# EAGLE design DigitalStethoscope (EAGLE 8.1.0)

## Sheet 1 of 5
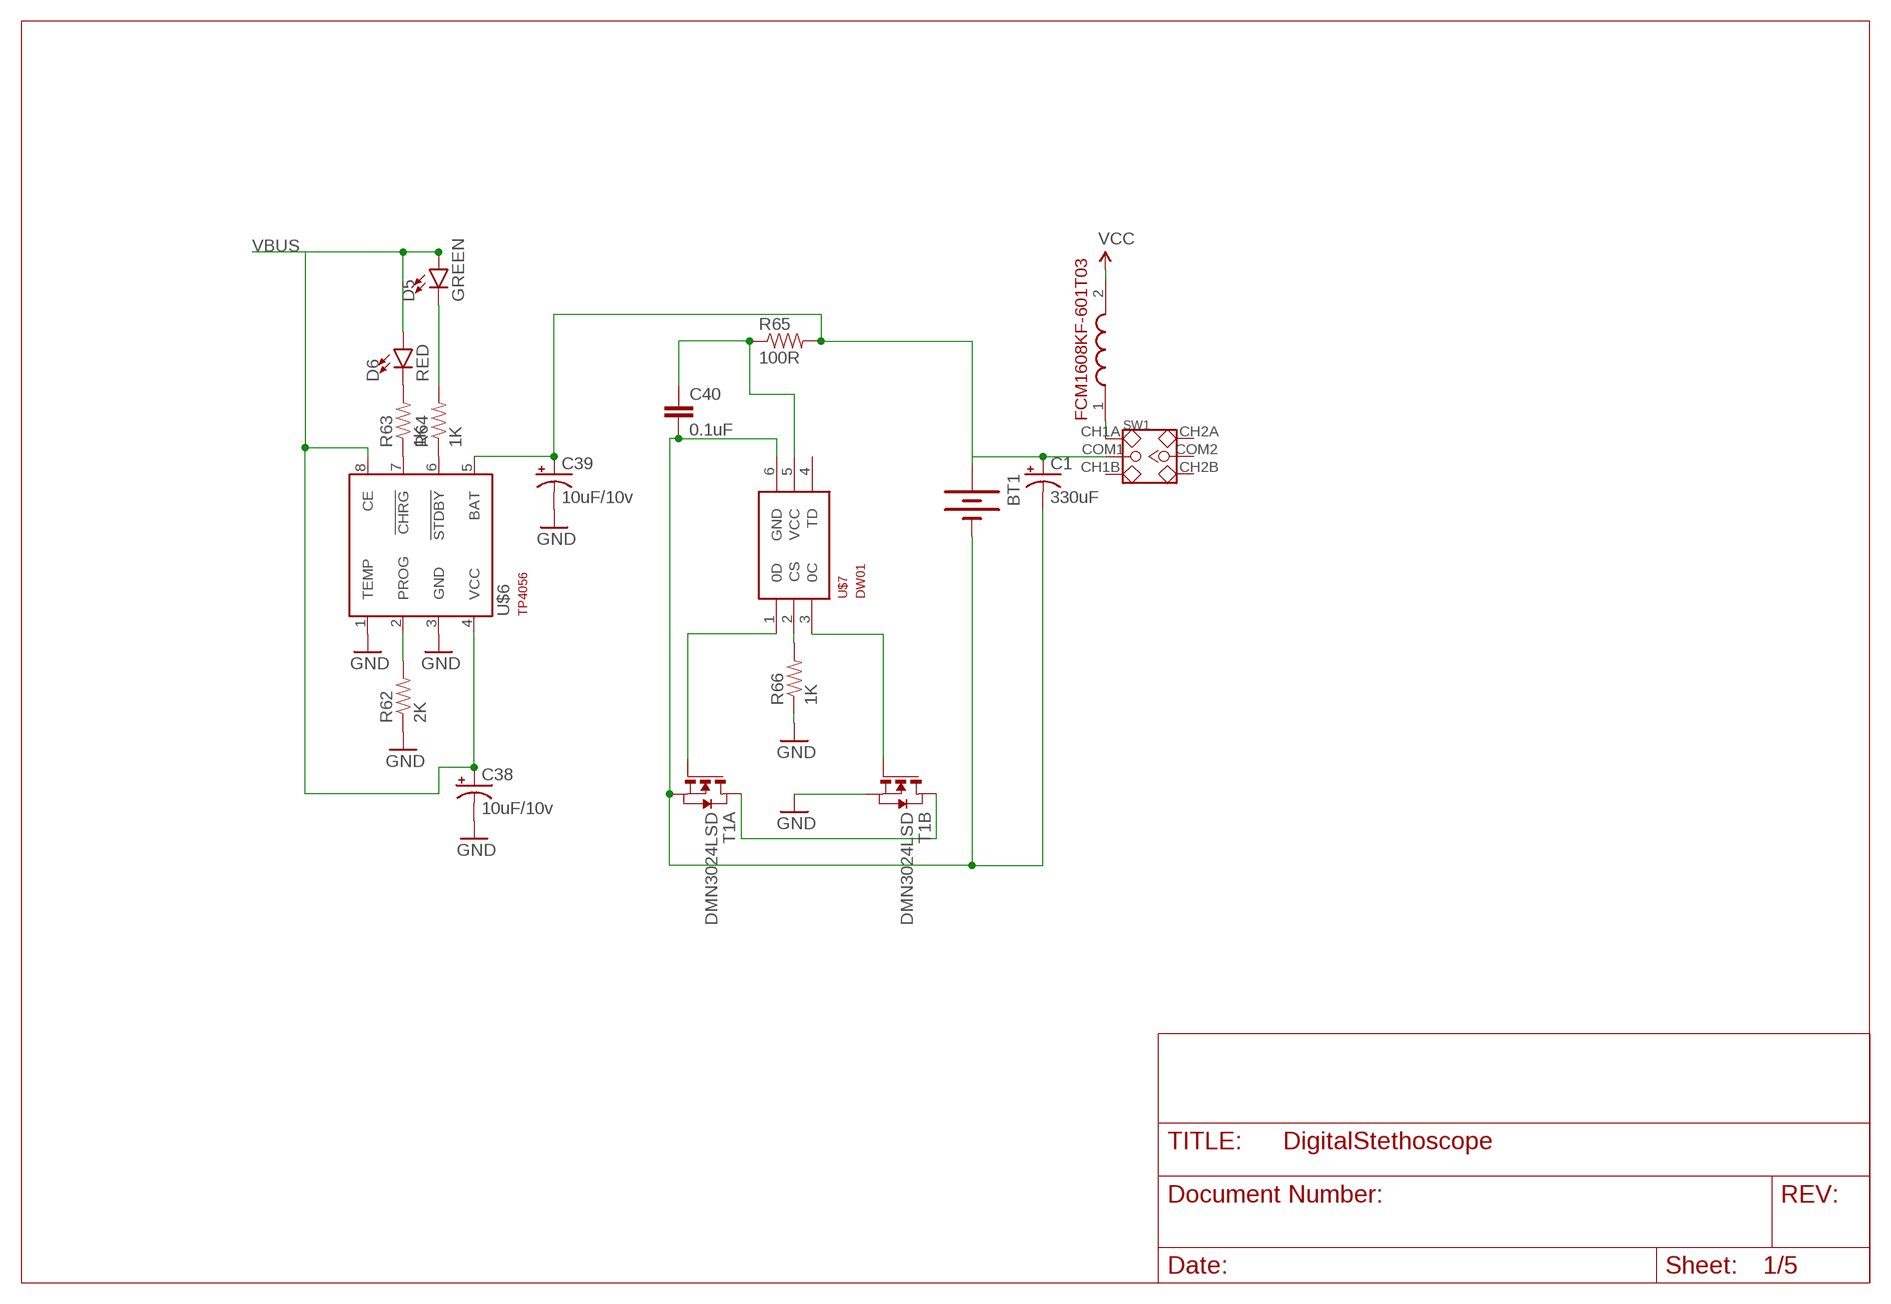
[diagram p0: schematic, sheet 1]

### Parts
BT1  BATTERYLIPO-TABS  [LIPO-110-TABS]
C1  330uF  CPOL-USE3.5-8  [E3,5-8]
C38  10uF/10v  CAP_POL1206-KIT  [EIA3216-KIT]
C39  10uF/10v  CAP_POL1206-KIT  [EIA3216-KIT]
C40  0.1uF  0.1UF-100V-10%(0603)  [0603-CAP]
D5  GREEN  LED-BLUE0603  [LED-0603]
D6  RED  LED-BLUE0603  [LED-0603]
R62  2K  1KOHM1/10W1%(0603)  [0603-RES]
R63  1K  1KOHM1/10W1%(0603)  [0603-RES]
R64  1K  1KOHM1/10W1%(0603)  [0603-RES]
R65  100R  1KOHM1/10W1%(0603)  [0603-RES]
R66  1K  1KOHM1/10W1%(0603)  [0603-RES]
SW1  SMD-TOGGLE-SWITCH-2CH(2X3P-7X3.5MM)  [SW6-2.54-SMD-7.0X3.5X1.5MM]
T1  DMN3024LSD  [TSSOP-8]
U$4  FCM1608KF-601T03  [FCM1608KF-601T03]
U$6  TP4056  [SOT23-8]
U$7  DW01  [SOT23-6]

### Nets
GND: C38.C(-) C39.C(-) R62.1 R66.1 T1.6(B:S) T1.7(B:S) U$6.1(TEMP) U$6.3(GND) ; also sheet 2,3,4,5
N$4: BT1.+ C1.+ C39.A(+) R65.2 SW1.COM1 U$6.5(BAT)
N$58: R62.2 U$6.2(PROG)
N$59: R63.1 U$6.7(!CHRG)
N$60: R64.1 U$6.6(!STDBY)
N$61: D6.C R63.2
N$62: D5.C R64.2
N$65: C40.1 R65.1 U$7.5(VCC)
N$66: BT1.- C1.- C40.2 T1.2(A:S) T1.3(A:S) U$7.6(GND)
N$67: T1.4(A:G) U$7.1(0D)
N$68: R66.2 U$7.2(CS)
N$69: T1.1(A:D) T1.8(B:D)
N$70: T1.5(B:G) U$7.3(0C)
N$73: SW1.CH1A U$4.1(1.IN)
VBUS: C38.A(+) D5.A D6.A U$6.4(VCC) U$6.8(CE) ; also sheet 2
VCC: U$4.2(2.OUT) ; also sheet 2,4,5
Unconnected: SW1.CH1B SW1.CH2A SW1.CH2B SW1.COM2 U$7.4(TD)

## Sheet 2 of 5
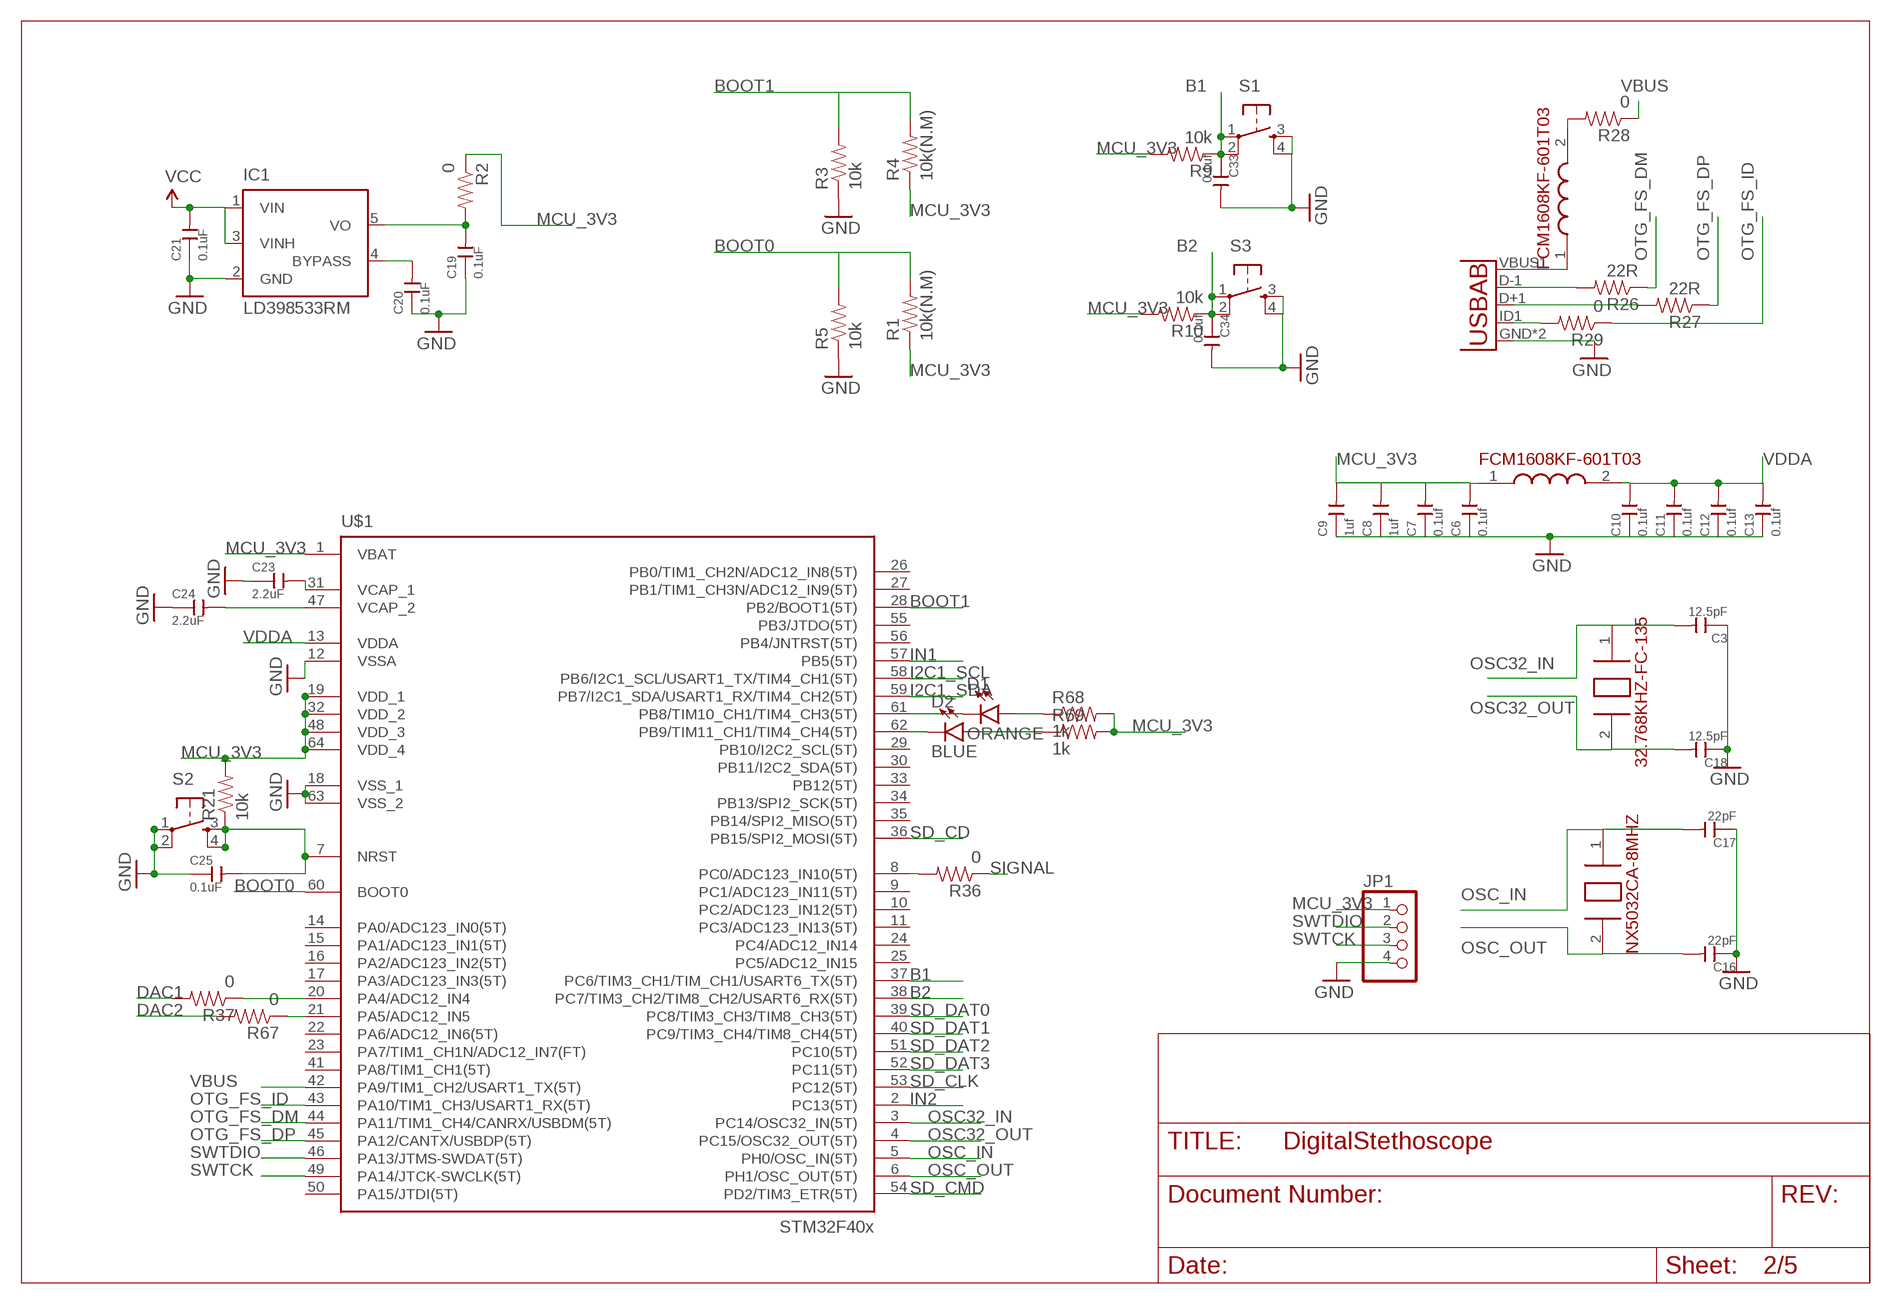
[diagram p1: schematic, sheet 2]

### Parts
C3  12.5pF  CERAMIC-4.7UF-10V-10%-X5R(0603)  [C0603]
C6  0.1uf  CERAMIC-4.7UF-10V-10%-X5R(0603)  [C0603]
C7  0.1uf  CERAMIC-4.7UF-10V-10%-X5R(0603)  [C0603]
C8  1uf  CERAMIC-4.7UF-10V-10%-X5R(0603)  [C0603]
C9  1uf  CERAMIC-4.7UF-10V-10%-X5R(0603)  [C0603]
C10  0.1uf  CERAMIC-4.7UF-10V-10%-X5R(0603)  [C0603]
C11  0.1uf  CERAMIC-4.7UF-10V-10%-X5R(0603)  [C0603]
C12  0.1uf  CERAMIC-4.7UF-10V-10%-X5R(0603)  [C0603]
C13  0.1uf  CERAMIC-4.7UF-10V-10%-X5R(0603)  [C0603]
C16  22pF  CERAMIC-4.7UF-10V-10%-X5R(0603)  [C0603]
C17  22pF  CERAMIC-4.7UF-10V-10%-X5R(0603)  [C0603]
C18  12.5pF  CERAMIC-4.7UF-10V-10%-X5R(0603)  [C0603]
C19  0.1uF  CERAMIC-0.5PF-50V-0.1PF-NPO(0603)  [C0603]
C20  0.1uF  CERAMIC-0.5PF-50V-0.1PF-NPO(0603)  [C0603]
C21  0.1uF  CERAMIC-0.5PF-50V-0.1PF-NPO(0603)  [C0603]
C23  2.2uF  CERAMIC-0.5PF-50V-0.1PF-NPO(0603)  [C0603]
C24  2.2uF  CERAMIC-0.5PF-50V-0.1PF-NPO(0603)  [C0603]
C25  0.1uF  CERAMIC-0.5PF-50V-0.1PF-NPO(0603)  [C0603]
C33  0.1uf  CERAMIC-4.7UF-10V-10%-X5R(0603)  [C0603]
C34  0.1uf  CERAMIC-4.7UF-10V-10%-X5R(0603)  [C0603]
D1  ORANGE  LED-BLUE0603  [LED-0603]
D2  BLUE  LED-BLUE0603  [LED-0603]
IC1  LD398533RM  [SOT23-5L]
JP1  PINHD-1X4  [1X04]
R1  10k(N.M)  0OHM1/10W5%(0603)  [0603]
R2  0  390OHM1/10W1%(0603)  [0603-RES]
R3  10k  0OHM1/10W5%(0603)  [0603]
R4  10k(N.M)  0OHM1/10W5%(0603)  [0603]
R5  10k  0OHM1/10W5%(0603)  [0603]
R9  10k  0OHM1/10W5%(0603)  [0603]
R10  10k  0OHM1/10W5%(0603)  [0603]
R21  10k  390OHM1/10W1%(0603)  [0603-RES]
R26  22R  390OHM1/10W1%(0603)  [0603-RES]
R27  22R  390OHM1/10W1%(0603)  [0603-RES]
R28  0  390OHM1/10W1%(0603)  [0603-RES]
R29  0  390OHM1/10W1%(0603)  [0603-RES]
R36  0  390OHM1/10W1%(0603)  [0603-RES]
R37  0  390OHM1/10W1%(0603)  [0603-RES]
R67  0  390OHM1/10W1%(0603)  [0603-RES]
R68  1k  390OHM1/10W1%(0603)  [0603-RES]
R69  1k  390OHM1/10W1%(0603)  [0603-RES]
S1  TAC_SWITCHSMD  [TACTILE_SWITCH_SMD]
S2  TAC_SWITCHSMD  [TACTILE_SWITCH_SMD]
S3  TAC_SWITCHSMD  [TACTILE_SWITCH_SMD]
U4  USB""  [USB-MICRO-SMD]
U$1  STM32F405R  [TQFP64]
U$2  32.768KHZ-FC-135  [32.768KHZ-FC-135]
U$3  FCM1608KF-601T03  [FCM1608KF-601T03]
U$5  FCM1608KF-601T03  [FCM1608KF-601T03]
U$8  NX5032CA-8MHZ  [NX5032CA-8MHZ]

### Nets
B1: C33.1 R9.1 S1.1 S1.2 U$1.37(PC6/TIM3_CH1/TIM_CH1/USART6_TX(5T))
B2: C34.1 R10.1 S3.1 S3.2 U$1.38(PC7/TIM3_CH2/TIM8_CH2/USART6_RX(5T))
BOOT0: R1.2 R5.2 U$1.60(BOOT0)
BOOT1: R3.2 R4.2 U$1.28(PB2/BOOT1(5T))
DAC1: R37.2 ; also sheet 3
DAC2: R67.2 ; also sheet 3
GND: C3.1 C6.1 C7.1 C8.1 C9.1 C10.1 C11.1 C12.1 C13.1 C16.1 C17.1 C18.1 C19.1 C20.1 C21.1 C23.1 C24.1 C25.1 C33.2 C34.2 IC1.2(GND) JP1.4 R3.1 R5.1 S1.3 S1.4 S2.1 S2.2 S3.3 S3.4 U4.GND U4.GND1(GND) U$1.12(VSSA) U$1.18(VSS_1) U$1.63(VSS_2) ; also sheet 1,3,4,5
I2C1_SCL: U$1.58(PB6/I2C1_SCL/USART1_TX/TIM4_CH1(5T)) ; also sheet 5
I2C1_SDA: U$1.59(PB7/I2C1_SDA/USART1_RX/TIM4_CH2(5T)) ; also sheet 5
IN1: U$1.57(PB5(5T)) ; also sheet 3
IN2: U$1.2(PC13(5T)) ; also sheet 3
MCU_3V3: C6.2 C7.2 C8.2 C9.2 JP1.1 R1.1 R2.1 R4.1 R9.2 R10.2 R21.2 R68.2 R69.2 U$1.1(VBAT) U$1.19(VDD_1) U$1.32(VDD_2) U$1.48(VDD_3) U$1.64(VDD_4) U$3.1(1.IN) ; also sheet 3,4,5
N$18: C20.2 IC1.4(BYPASS)
N$22: R36.2 U$1.8(PC0/ADC123_IN10(5T))
N$25: R26.2 U4.D-1(D-)
N$26: C23.2 U$1.31(VCAP_1)
N$27: C24.2 U$1.47(VCAP_2)
N$28: R37.1 U$1.20(PA4/ADC12_IN4)
N$29: C25.2 R21.1 S2.3 S2.4 U$1.7(NRST)
N$30: C19.2 IC1.5(VO) R2.2
N$31: R27.2 U4.D+1(D+)
N$32: U4.VBUS1(VBUS) U$5.1(1.IN)
N$33: R29.2 U4.ID1(USBID)
N$34: R28.2 U$5.2(2.OUT)
N$71: R67.1 U$1.21(PA5/ADC12_IN5)
N$74: D2.C U$1.62(PB9/TIM11_CH1/TIM4_CH4(5T))
N$75: D1.C U$1.61(PB8/TIM10_CH1/TIM4_CH3(5T))
N$76: D1.A R68.1
N$77: D2.A R69.1
OSC32_IN: C3.2 U$1.3(PC14/OSC32_IN(5T)) U$2.1(1.XIN)
OSC32_OUT: C18.2 U$1.4(PC15/OSC32_OUT(5T)) U$2.2(2.XIN)
OSC_IN: C17.2 U$1.5(PH0/OSC_IN(5T)) U$8.1(1.XIN)
OSC_OUT: C16.2 U$1.6(PH1/OSC_OUT(5T)) U$8.2(2.XOUT)
OTG_FS_DM: R26.1 U$1.44(PA11/TIM1_CH4/CANRX/USBDM(5T))
OTG_FS_DP: R27.1 U$1.45(PA12/CANTX/USBDP(5T))
OTG_FS_ID: R29.1 U$1.43(PA10/TIM1_CH3/USART1_RX(5T))
SD_CD: U$1.36(PB15/SPI2_MOSI(5T)) ; also sheet 5
SD_CLK: U$1.53(PC12(5T)) ; also sheet 5
SD_CMD: U$1.54(PD2/TIM3_ETR(5T)) ; also sheet 5
SD_DAT0: U$1.39(PC8/TIM3_CH3/TIM8_CH3(5T)) ; also sheet 5
SD_DAT1: U$1.40(PC9/TIM3_CH4/TIM8_CH4(5T)) ; also sheet 5
SD_DAT2: U$1.51(PC10(5T)) ; also sheet 5
SD_DAT3: U$1.52(PC11(5T)) ; also sheet 5
SIGNAL: R36.1 ; also sheet 3,4
SWTCK: JP1.3 U$1.49(PA14/JTCK-SWCLK(5T))
SWTDIO: JP1.2 U$1.46(PA13/JTMS-SWDAT(5T))
VBUS: R28.1 U$1.42(PA9/TIM1_CH2/USART1_TX(5T)) ; also sheet 1
VCC: C21.2 IC1.1(VIN) IC1.3(VINH) ; also sheet 1,4,5
VDDA: C10.2 C11.2 C12.2 C13.2 U$1.13(VDDA) U$3.2(2.OUT)
Unconnected: U$1.9(PC1/ADC123_IN11(5T)) U$1.10(PC2/ADC123_IN12(5T)) U$1.11(PC3/ADC123_IN13(5T)) U$1.14(PA0/ADC123_IN0(5T)) U$1.15(PA1/ADC123_IN1(5T)) U$1.16(PA2/ADC123_IN2(5T)) U$1.17(PA3/ADC123_IN3(5T)) U$1.22(PA6/ADC12_IN6(5T)) U$1.23(PA7/TIM1_CH1N/ADC12_IN7(FT)) U$1.24(PC4/ADC12_IN14) U$1.25(PC5/ADC12_IN15) U$1.26(PB0/TIM1_CH2N/ADC12_IN8(5T)) U$1.27(PB1/TIM1_CH3N/ADC12_IN9(5T)) U$1.29(PB10/I2C2_SCL(5T)) U$1.30(PB11/I2C2_SDA(5T)) U$1.33(PB12(5T)) U$1.34(PB13/SPI2_SCK(5T)) U$1.35(PB14/SPI2_MISO(5T)) U$1.41(PA8/TIM1_CH1(5T)) U$1.50(PA15/JTDI(5T)) U$1.55(PB3/JTDO(5T)) U$1.56(PB4/JNTRST(5T))

## Sheet 3 of 5
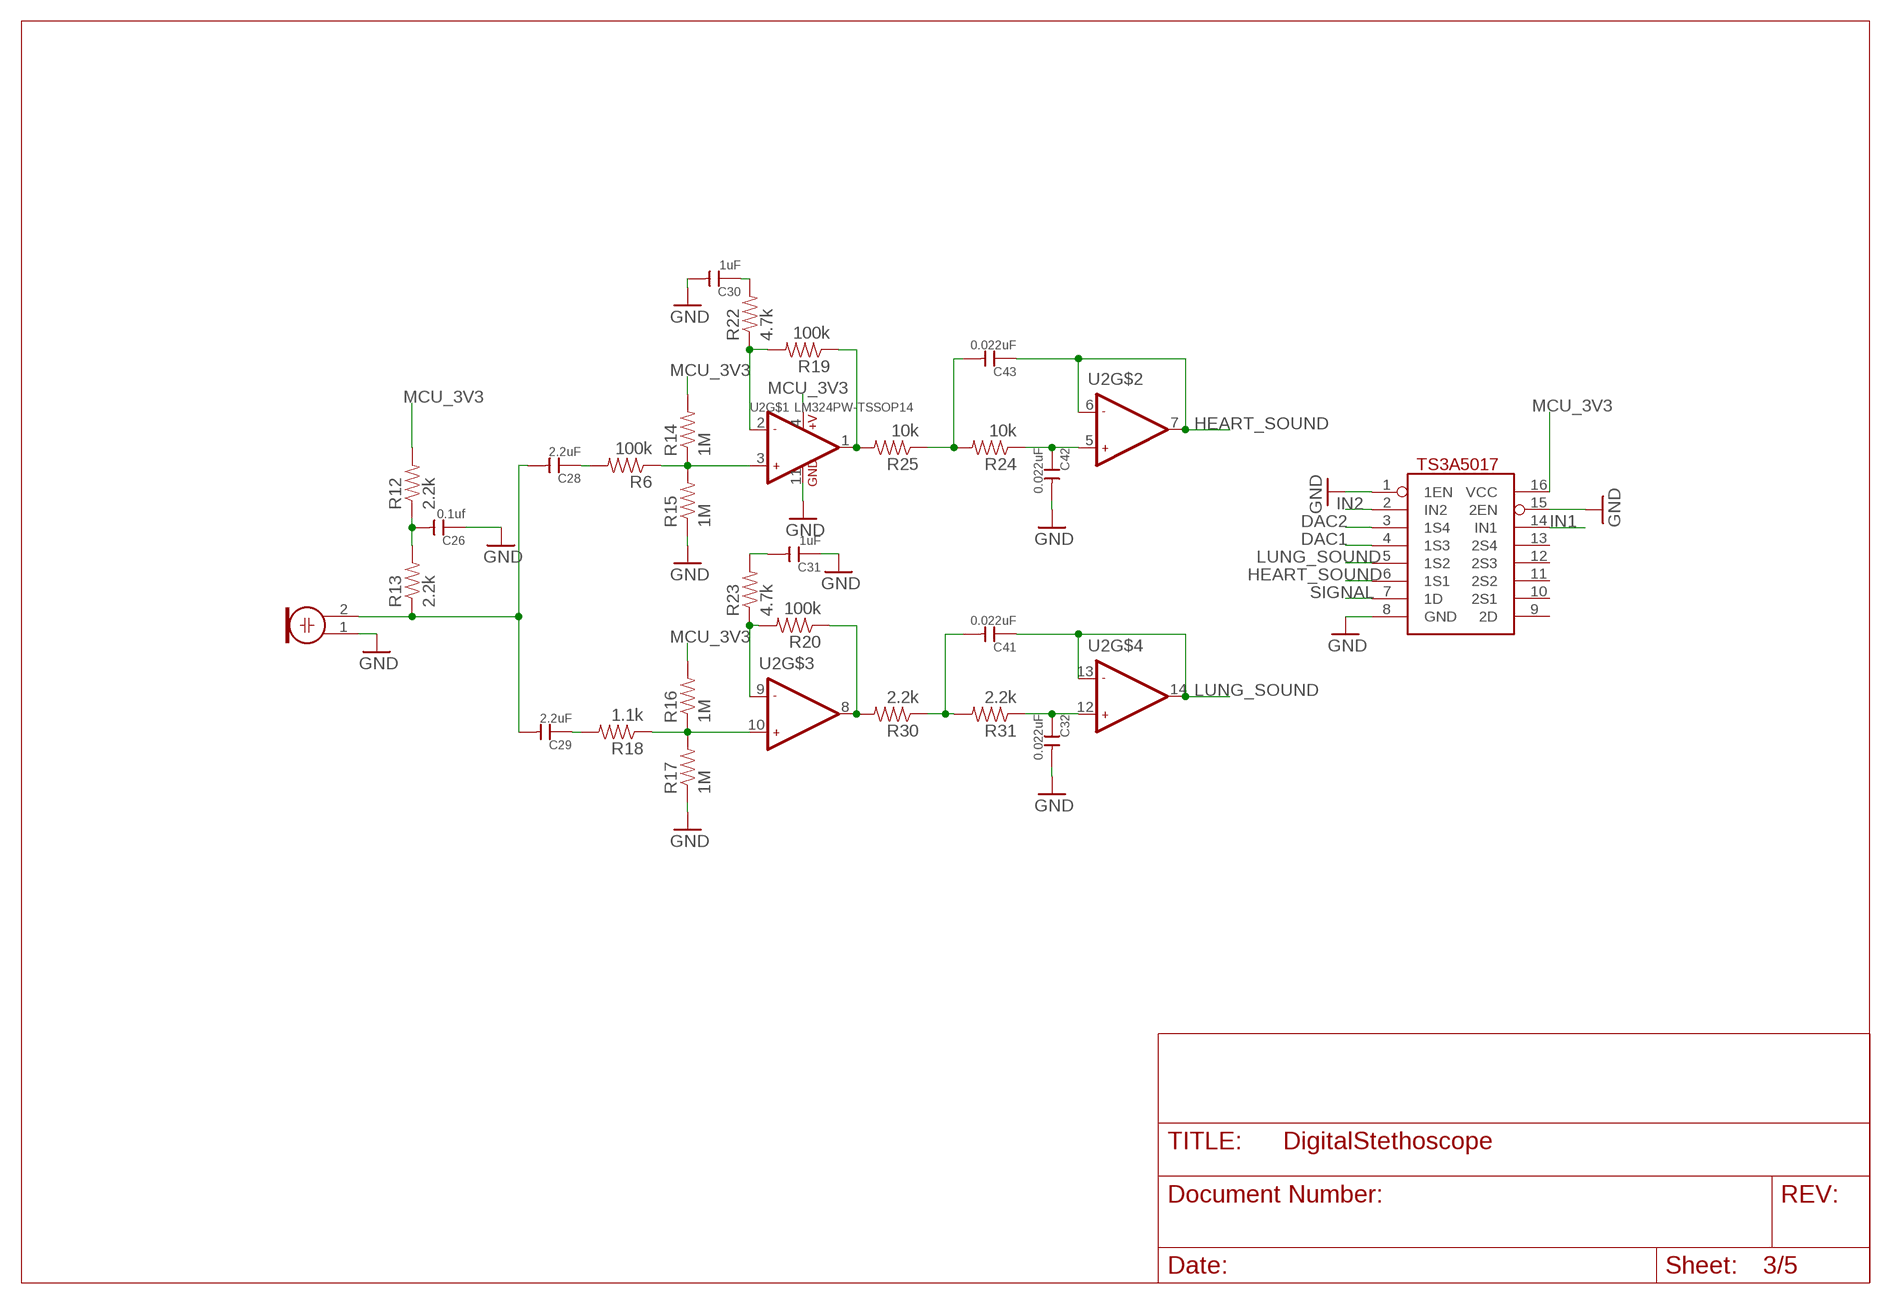
[diagram p2: schematic, sheet 3]

### Parts
ASW  MUX-TS3A5017  [SO16]
C26  0.1uf  CERAMIC-4.7UF-10V-10%-X5R(0603)  [C0603]
C28  2.2uF  CERAMIC-4.7UF-10V-10%-X5R(0603)  [C0603]
C29  2.2uF  CERAMIC-4.7UF-10V-10%-X5R(0603)  [C0603]
C30  1uF  CERAMIC-4.7UF-10V-10%-X5R(0603)  [C0603]
C31  1uF  CERAMIC-4.7UF-10V-10%-X5R(0603)  [C0603]
C32  0.022uF  CERAMIC-4.7UF-10V-10%-X5R(0603)  [C0603]
C41  0.022uF  CERAMIC-4.7UF-10V-10%-X5R(0603)  [C0603]
C42  0.022uF  CERAMIC-4.7UF-10V-10%-X5R(0603)  [C0603]
C43  0.022uF  CERAMIC-4.7UF-10V-10%-X5R(0603)  [C0603]
M1  ELECTRET_MICROPHON-F6035AP  [F6035AP]
R6  100k  390OHM1/10W1%(0603)  [0603-RES]
R12  2.2k  390OHM1/10W1%(0603)  [0603-RES]
R13  2.2k  390OHM1/10W1%(0603)  [0603-RES]
R14  1M  390OHM1/10W1%(0603)  [0603-RES]
R15  1M  390OHM1/10W1%(0603)  [0603-RES]
R16  1M  390OHM1/10W1%(0603)  [0603-RES]
R17  1M  390OHM1/10W1%(0603)  [0603-RES]
R18  1.1k  390OHM1/10W1%(0603)  [0603-RES]
R19  100k  390OHM1/10W1%(0603)  [0603-RES]
R20  100k  390OHM1/10W1%(0603)  [0603-RES]
R22  4.7k  390OHM1/10W1%(0603)  [0603-RES]
R23  4.7k  390OHM1/10W1%(0603)  [0603-RES]
R24  10k  390OHM1/10W1%(0603)  [0603-RES]
R25  10k  390OHM1/10W1%(0603)  [0603-RES]
R30  2.2k  390OHM1/10W1%(0603)  [0603-RES]
R31  2.2k  390OHM1/10W1%(0603)  [0603-RES]
U2  LM324PW-TSSOP14  AMPLIFIER-LM324PW(TSSOP14)  [TSSOP14-0.65-5X4.4MM]

### Nets
DAC1: ASW.4(1S3) ; also sheet 2
DAC2: ASW.3(1S4) ; also sheet 2
GND: ASW.1(1EN) ASW.8(GND) ASW.15(2EN) C26.1 C30.2 C31.1 C32.2 C42.2 M1.1 R15.1 R17.1 U2.11(GND) ; also sheet 1,2,4,5
HEART_SOUND: ASW.6(1S1) C43.1 U2.6(-IN2) U2.7(OUT2)
IN1: ASW.14(IN1) ; also sheet 2
IN2: ASW.2(IN2) ; also sheet 2
LUNG_SOUND: ASW.5(1S2) C41.1 U2.13(-IN2) U2.14(OUT2)
MCU_3V3: ASW.16(VCC) R12.2 R14.2 R16.2 U2.4(+V) ; also sheet 2,4,5
N$1: C26.2 R12.1 R13.2
N$3: C28.2 C29.2 M1.2 R13.1
N$6: R6.1 R14.1 R15.2 U2.3(+IN1)
N$10: R16.1 R17.2 R18.1 U2.10(+IN2)
N$11: C29.1 R18.2
N$12: C28.1 R6.2
N$13: R19.2 R22.1 U2.2(-IN1)
N$14: R19.1 R25.2 U2.1(OUT1)
N$15: C30.1 R22.2
N$16: R20.2 R23.1 U2.9(-IN2)
N$17: R20.1 R30.2 U2.8(OUT2)
N$19: C31.2 R23.2
N$20: C43.2 R24.2 R25.1
N$21: C42.1 R24.1 U2.5(+IN2)
N$23: C41.2 R30.1 R31.2
N$24: C32.1 R31.1 U2.12(+IN2)
SIGNAL: ASW.7(1D) ; also sheet 2,4
Unconnected: ASW.9(2D) ASW.10(2S1) ASW.11(2S2) ASW.12(2S3) ASW.13(2S4)

## Sheet 4 of 5
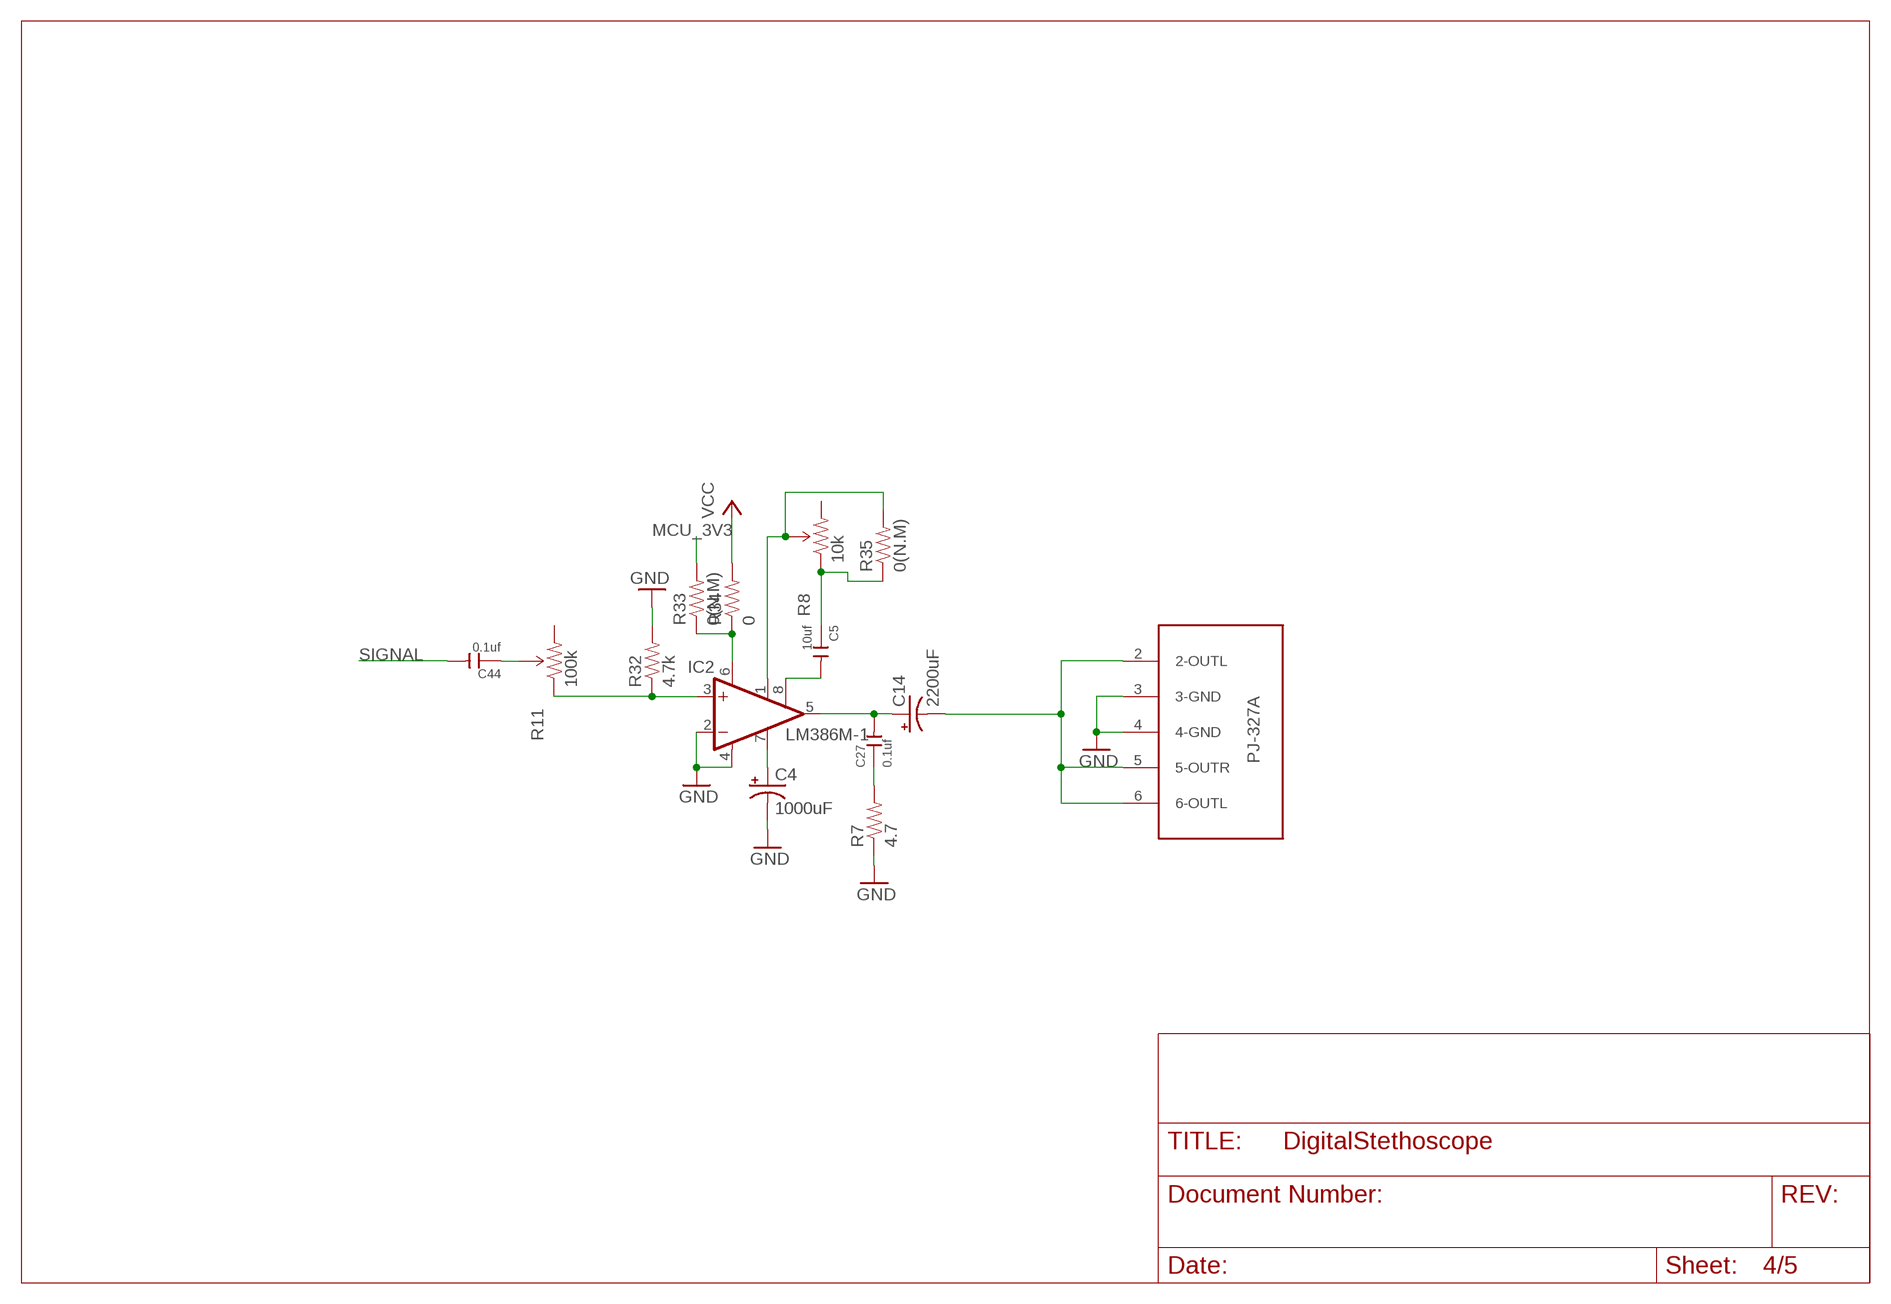
[diagram p3: schematic, sheet 4]

### Parts
C4  1000uF  CPOL-USE3.5-8  [E3,5-8]
C5  10uf  CERAMIC-4.7UF-10V-10%-X5R(0603)  [C0603]
C14  2200uF  CPOL-USE3.5-8  [E3,5-8]
C27  0.1uf  CERAMIC-4.7UF-10V-10%-X5R(0603)  [C0603]
C44  0.1uf  CERAMIC-4.7UF-10V-10%-X5R(0603)  [C0603]
IC2  LM386M-1  [SO08]
R7  4.7  390OHM1/10W1%(0603)  [0603-RES]
R8  10k  TRIMPOT-2  [TRIMPOT_TC33]
R11  100k  TRIMPOT-2  [TRIMPOT_TC33]
R32  4.7k  390OHM1/10W1%(0603)  [0603-RES]
R33  0(N.M)  390OHM1/10W1%(0603)  [0603-RES]
R34  0  390OHM1/10W1%(0603)  [0603-RES]
R35  0(N.M)  390OHM1/10W1%(0603)  [0603-RES]
U$9  PJ-327A  [PJ-327A]

### Nets
GND: C4.- IC2.2(-IN) IC2.4(GND) R7.1 R32.2 U$9.3(3-GND) U$9.4(4-GND) ; also sheet 1,2,3,5
MCU_3V3: R33.2 ; also sheet 2,3,5
N$35: IC2.3(+IN) R11.1(CCW) R32.1
N$36: C44.1 R11.2(WIPER)
N$37: C4.+ IC2.7(BYPASS)
N$38: C14.+ C27.2 IC2.5(OUT)
N$45: C27.1 R7.2
N$46: C5.2 IC2.8(GAIN)
N$57: C5.1 R8.1(CCW) R35.1
N$63: IC2.1(GAIN) R8.2(WIPER) R35.2
N$64: C14.- U$9.2(2-OUTL) U$9.5(5-OUTR) U$9.6(6-OUTL)
N$72: IC2.6(VS) R33.1 R34.1
SIGNAL: C44.2 ; also sheet 2,3
VCC: R34.2 ; also sheet 1,2,5
Unconnected: R8.3(CW) R11.3(CW)

## Sheet 5 of 5
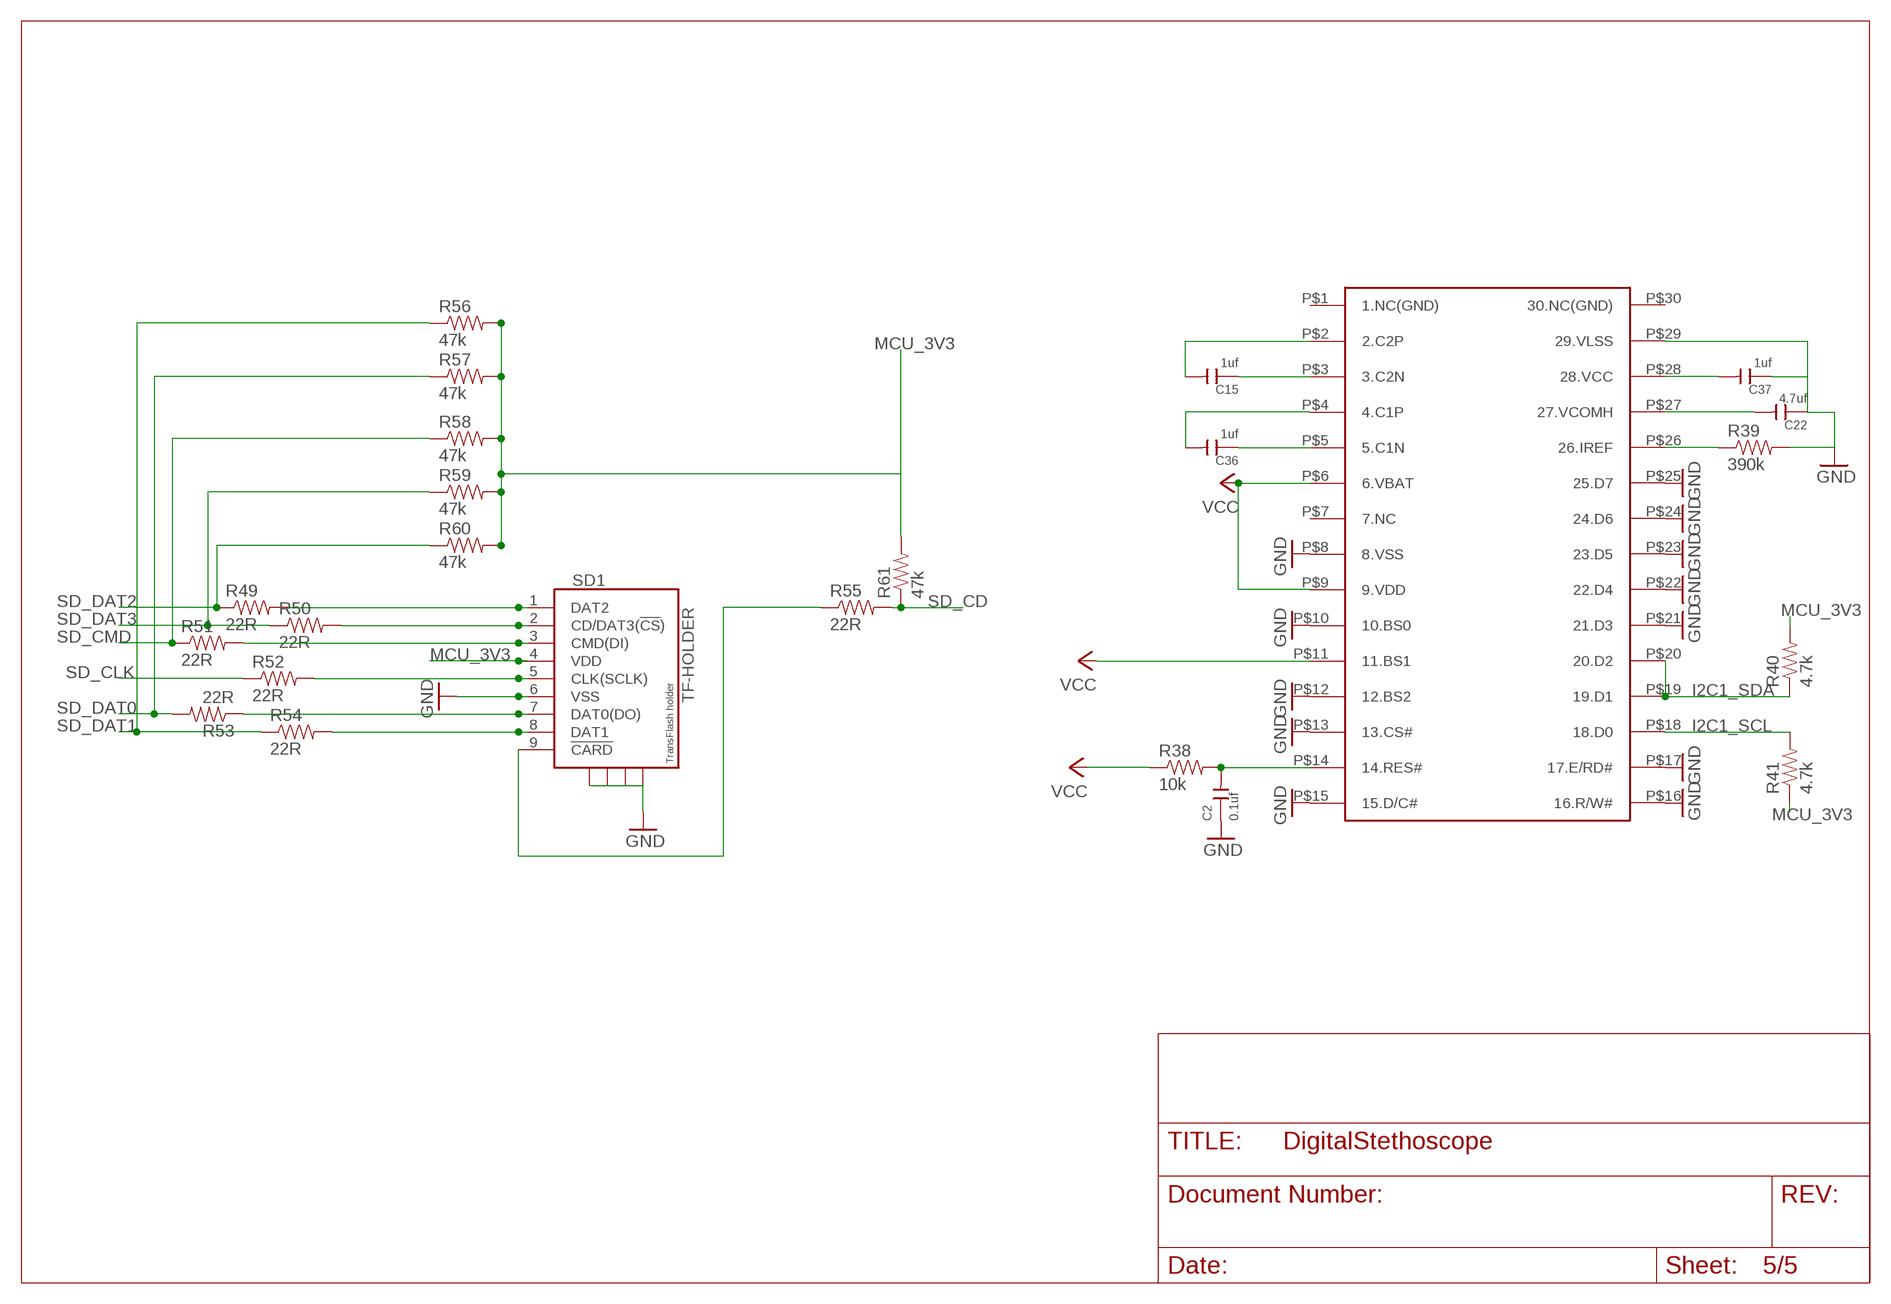
[diagram p4: schematic, sheet 5]

### Parts
C2  0.1uf  CERAMIC-4.7UF-10V-10%-X5R(0603)  [C0603]
C15  1uf  CERAMIC-4.7UF-10V-10%-X5R(0603)  [C0603]
C22  4.7uf  CERAMIC-4.7UF-10V-10%-X5R(0603)  [C0603]
C36  1uf  CERAMIC-4.7UF-10V-10%-X5R(0603)  [C0603]
C37  1uf  CERAMIC-4.7UF-10V-10%-X5R(0603)  [C0603]
R38  10k  0OHM1/10W5%(0603)  [0603]
R39  390k  0OHM1/10W5%(0603)  [0603]
R40  4.7k  0OHM1/10W5%(0603)  [0603]
R41  4.7k  0OHM1/10W5%(0603)  [0603]
R49  22R  100OHM1/10W1%(0603)  [0603-RES]
R50  22R  100OHM1/10W1%(0603)  [0603-RES]
R51  22R  100OHM1/10W1%(0603)  [0603-RES]
R52  22R  100OHM1/10W1%(0603)  [0603-RES]
R53  22R  100OHM1/10W1%(0603)  [0603-RES]
R54  22R  100OHM1/10W1%(0603)  [0603-RES]
R55  22R  100OHM1/10W1%(0603)  [0603-RES]
R56  47k  100OHM1/10W1%(0603)  [0603-RES]
R57  47k  100OHM1/10W1%(0603)  [0603-RES]
R58  47k  100OHM1/10W1%(0603)  [0603-RES]
R59  47k  100OHM1/10W1%(0603)  [0603-RES]
R60  47k  100OHM1/10W1%(0603)  [0603-RES]
R61  47k  100OHM1/10W1%(0603)  [0603-RES]
SD1  TF-HOLDER  [TF-PULL]
U$18  ER-OLED0.96  [ER-OLED0.96]

### Nets
GND: C2.1 C22.1 C37.1 R39.2 SD1.6(VSS) SD1.S1 SD1.S2 SD1.S3 SD1.S4 U$18.P$8(8.VSS) U$18.P$10(10.BS0) U$18.P$12(12.BS2) U$18.P$13(13.CS#) U$18.P$15(15.D/C#) U$18.P$16(16.R/W#) U$18.P$17(17.E/RD#) U$18.P$21(21.D3) U$18.P$22(22.D4) U$18.P$23(23.D5) U$18.P$24(24.D6) U$18.P$25(25.D7) U$18.P$29(29.VLSS) ; also sheet 1,2,3,4
I2C1_SCL: R41.2 U$18.P$18(18.D0) ; also sheet 2
I2C1_SDA: R40.1 U$18.P$19(19.D1) U$18.P$20(20.D2) ; also sheet 2
MCU_3V3: R40.2 R41.1 R56.2 R57.2 R58.2 R59.2 R60.2 R61.2 SD1.4(VDD) ; also sheet 2,3,4
N$7: R49.2 SD1.1(DAT2)
N$8: C2.2 R38.2 U$18.P$14(14.RES#)
N$9: C15.1 U$18.P$3(3.C2N)
N$39: C36.1 U$18.P$5(5.C1N)
N$40: C15.2 U$18.P$2(2.C2P)
N$41: C36.2 U$18.P$4(4.C1P)
N$42: R39.1 U$18.P$26(26.IREF)
N$43: C22.2 U$18.P$27(27.VCOMH)
N$44: C37.2 U$18.P$28(28.VCC)
N$51: R50.2 SD1.2(CD/DAT3(!CS!))
N$52: R51.2 SD1.3(CMD(DI))
N$53: R52.2 SD1.5(CLK(SCLK))
N$54: R53.1 SD1.7(DAT0(DO))
N$55: R54.2 SD1.8(DAT1)
N$56: R55.1 SD1.9(!CARD)
SD_CD: R55.2 R61.1 ; also sheet 2
SD_CLK: R52.1 ; also sheet 2
SD_CMD: R51.1 R58.1 ; also sheet 2
SD_DAT0: R53.2 R57.1 ; also sheet 2
SD_DAT1: R54.1 R56.1 ; also sheet 2
SD_DAT2: R49.1 R60.1 ; also sheet 2
SD_DAT3: R50.1 R59.1 ; also sheet 2
VCC: R38.1 U$18.P$6(6.VBAT) U$18.P$9(9.VDD) U$18.P$11(11.BS1) ; also sheet 1,2,4
Unconnected: U$18.P$1(1.NC(GND)) U$18.P$7(7.NC) U$18.P$30(30.NC(GND))

## Library data of the parts
ASW = SparkFun-AnalogIC:MUX-TS3A5017: Dual-channel 4:1 analog mux
BT1 = SparkFun-Retired:BATTERY: Battery - Single Cell A variety of battery chemistries, sizes, and footprints. Including AA, AAA, 18650 (PRT-12895), 20mm coin cell and 12mm coin cell. 20MM_4LEGS, BATT-10373
C1 C4 C14 = adafruit:CPOL-US: POLARIZED CAPACITOR, American symbol
C2 C3 C5-C13 C15-C18 C26-C34 C36 C37 C41-C44 = Seeed-OPL-Capacitor:CERAMIC-4.7UF-10V-10%-X5R(0603): 302010111; MPN: CC0603KRX5R6BB475; VALUE: 4.7uf
C19-C21 C23-C25 = Seeed-OPL-Capacitor:CERAMIC-0.5PF-50V-0.1PF-NPO(0603): 302010115; VALUE: 0.5PF 50V
C22 = Seeed-OPL-Capacitor:CERAMIC-4.7UF-10V-10%-X5R(0603): 302010111; MPN: CC0603KRX5R6BB475
C38 C39 = SparkFun-Capacitors:CAP_POL: Capacitor Polarized These are standard SMD and PTH capacitors. Normally 10uF, 47uF, and 100uF in electrolytic and tantalum varieties. Always verify the external diameter of the through hole cap, it varies with capacity, voltage, and manufacturer. The EIA devices should be standard.
C40 = SparkFun-Capacitors:0.1UF-100V-10%(0603): CAP-08390; PROD_ID: CAP-08390
D1 D5 D6 = SparkFun-LED:LED-BLUE: Blue SMD LED Used in manufacturing of various products at SparkFun Packages: 0603 - SMD 0603 package [Product Link] <http://www.digikey.com/product-detail/en/SMLE12BC7TT86/511-1589-2-ND/1641808> 1206 - SMD1206 package [Product Link] <http://www.digikey.com/product-detail/en/lite-on-inc/LTST-C150TBKT/160-1643-1-ND/573584> SparkFun Products: ESP8266 Thing-Dev Board <https://www.sparkfun.com/products/13711> RedBoard <https://www.sparkfun.com/products/12757>; PROD_ID: DIO-08575; VALUE: BLUE
D2 = SparkFun-LED:LED-BLUE: Blue SMD LED Used in manufacturing of various products at SparkFun Packages: 0603 - SMD 0603 package [Product Link] <http://www.digikey.com/product-detail/en/SMLE12BC7TT86/511-1589-2-ND/1641808> 1206 - SMD1206 package [Product Link] <http://www.digikey.com/product-detail/en/lite-on-inc/LTST-C150TBKT/160-1643-1-ND/573584> SparkFun Products: ESP8266 Thing-Dev Board <https://www.sparkfun.com/products/13711> RedBoard <https://www.sparkfun.com/products/12757>; PROD_ID: DIO-08575
IC1 = st-microelectronics:LD3985: Ultra low drop and low noise BiCMOS voltage regulators Source: www.st.com LD3985.pdf
IC2 = linear:LM386?-*: Low Voltage Audio Power Amplifier Source: http://cache.national.com/ds/LM/LM386.pdf
JP1 = pinhead:PINHD-1X4: PIN HEADER
M1 = microphon:ELECTRET_MICROPHON-: Electret Condenser Microphone
R1 R3-R5 R9 R10 R38-R41 = SparkFun-Resistors:0OHM1/10W5%(0603): RES-08609; PROD_ID: RES-08609; VALUE: 0
R2 R6 R7 R12-R37 R67-R69 = SparkFun-Resistors:390OHM1/10W1%(0603): RES-07864; PROD_ID: RES-07864; VALUE: 390
R8 R11 = SparkFun-Electromechanical:TRIMPOT: Various small potentiometers for "set-and-forget" applications
R49-R61 = SparkFun-Resistors:100OHM1/10W1%(0603): RES-07863; PROD_ID: RES-07863; VALUE: 100
R62 R65 = SparkFun-Resistors:1KOHM1/10W1%(0603): RES-07856; PROD_ID: RES-07856; VALUE: 1K
R63 R64 R66 = SparkFun-Resistors:1KOHM1/10W1%(0603): RES-07856; PROD_ID: RES-07856
S1-S3 = SparkFun-Electromechanical:TAC_SWITCH: Momentary Switch Button commonly used for reset or general input. Spark Fun Electronics SKU : COM-00097 SMT- SWCH-08247; PROD_ID: SWCH-08247
SD1 = sd-mmc:TF-HOLDER: TF / Micro SD socket is PUSH-PUSH type, the card can be pushed into and auto locked and pushed out by simply press the card. Surface Mounting type.
SW1 = Seeed-OPL-Switch:SMD-TOGGLE-SWITCH-2CH(2X3P-7X3.5MM): 311030005
T1 = FS8205A:DMN3024LSD: DUAL N-CHANNEL ENHANCEMENT MODE MOSFET data sheet <http://goo.gl/dRgboR> Dave.Calaway Eagle Library <https://goo.gl/Muy1Tr>
U2 = Seeed-OPL-ic:AMPLIFIER-LM324PW(TSSOP14): 310020008; MPN: LM324PW
U4 = MicroUSB Long GND:USB: This is a USB AB connector that is compatible with USB OTG. i.e. this connector can serve as a host or device
U$1 = stm32f4:STM32F405R: STM32F405 64 pin LQFP reviewed: YES tested: YES
U$2 = 32.768KHZ-FC-135:32.768KHZ-FC-135
U$3-U$5 = FCM1608KF-601T03:FCM1608KF-601T03
U$6 = TP4056:TP4056: TP4056 Data sheet <http://goo.gl/J7k8TF> Dave.Calaway Eagle Library <https://goo.gl/Muy1Tr>
U$7 = DW01:DW01: The DW01-P battery protection IC is designed to protect lithium-ion/polymer battery from damage or degrading the lifetime due to overcharge, overdischarge, and/or overcurrent for one-cell lithium-ion/polymer battery powered systems, such as cellular phones. Data sheet <http://goo.gl/4y108d> Dave.Calaway Eagle Library <https://goo.gl/Muy1Tr>
U$8 = NX5032CA-8MHZ:NX5032CA-8MHZ
U$9 = PJ-327A:PJ-327A
U$18 = ER-OLED0.96:ER-OLED0.96

## Board
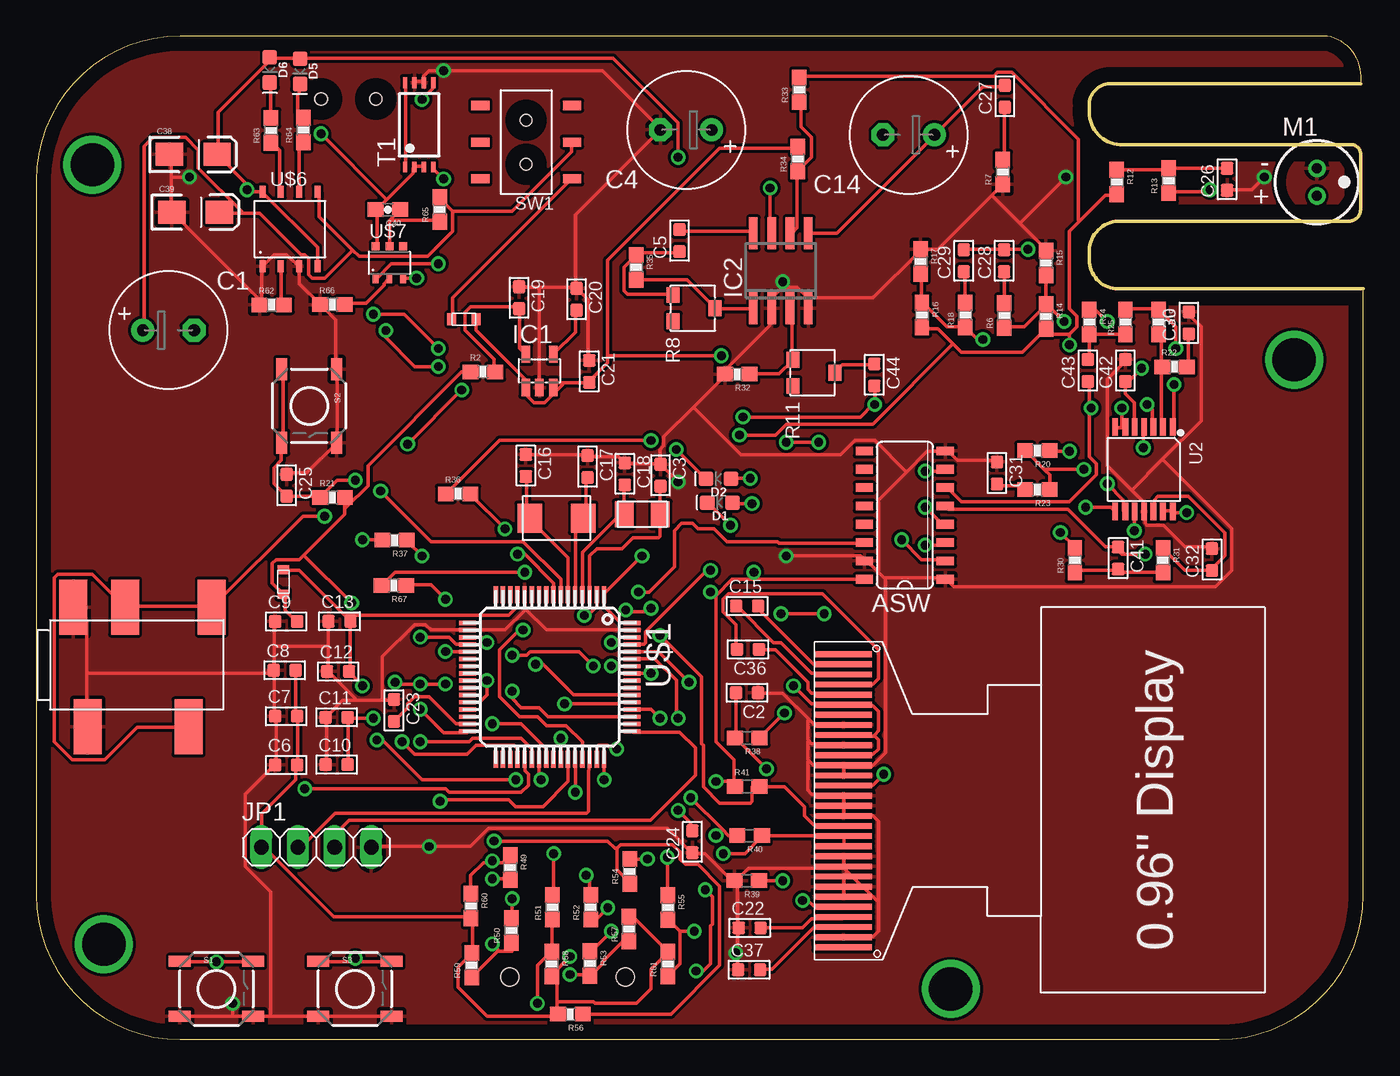
[diagram p5: board, top side]
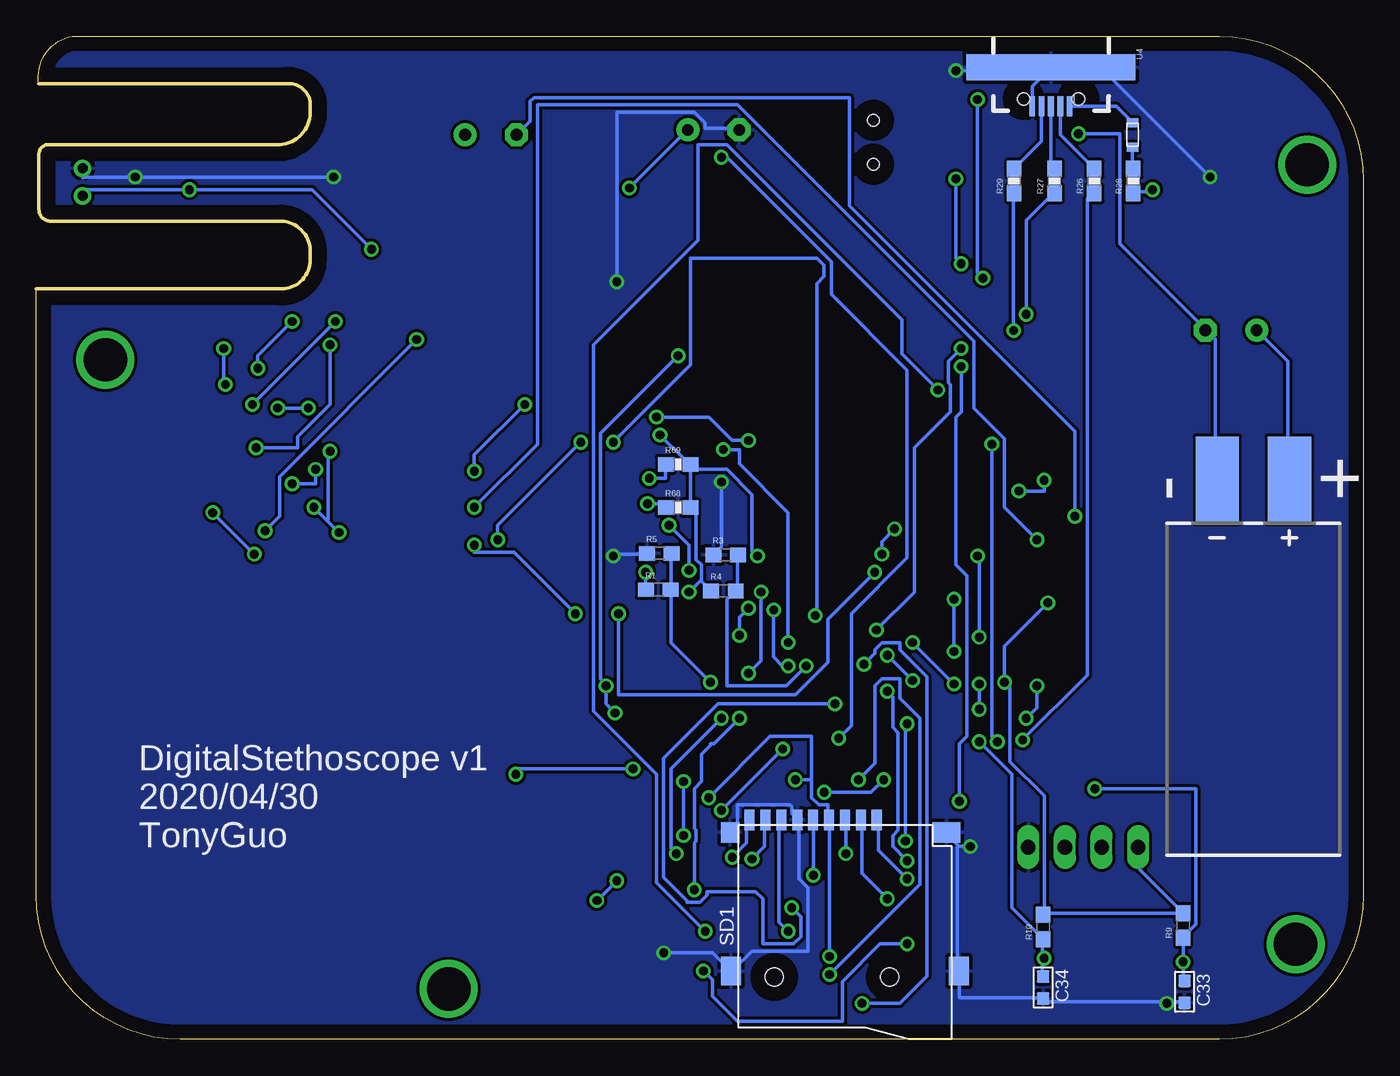
[diagram p6: board, bottom side, seen from below]

Size 92 x 69.52 mm. Coordinates in mm from the lower left corner, seen from the top.
Outline: 0,59.52 0,10 arc90 10,0 82,0 arc90 92,10 92,52 75,52 arc-90 73,54 73,54.5 arc-90 75,56.7 91,56.7 arc90 91.8,57.5 91.8,61.4 arc90 91.1,62 75.1,62 arc-90 73,64.4 73,65 arc-90 74.8,66.2 91.8,66.2 arc90 89.48,69.52 10,69.52 arc90 0,59.52
Copper layers (1*16): Top 0.035mm / dielectric 1.5mm / Bottom 0.035mm
Design rules "default": minimum track width 10mil, minimum drill 24mil, track to track 8mil, track to pad 8mil, pad to pad 8mil, via to via 8mil, smd to smd 8mil, copper to edge 40mil, drill to drill 8mil, minimum pad ring 10mil, minimum via ring 8mil, stop-mask expansion 4mil, vias tented up to drill 0mil, thermal gap 10mil

### Footprints (pad centres in the part's own frame; a part is rotated, then mirrored left to right if it is on the bottom)
SO16 = smd 0.6 x 1.2: 1 -4.445,-2.8; 2 -3.175,-2.8; 3 -1.905,-2.8; 4 -0.635,-2.8; 5 0.635,-2.8; 6 1.905,-2.8; 7 3.175,-2.8; 8 4.445,-2.8; 9 4.445,2.8; 10 3.175,2.8; 11 1.905,2.8; 12 0.635,2.8; 13 -0.635,2.8; 14 -1.905,2.8; 15 -3.175,2.8; 16 -4.445,2.8
LIPO-110-TABS = smd 3 x 6: + 2.5,14.5; - -2.5,14.5
E3,5-8 = drill 0.813 pad 1.6: + -1.778,0 | drill 0.813 pad 1.6 octagon: - 1.778,0
C0603 = smd 0.889 x 0.889: 1 0,0.762; 2 0,-0.762
EIA3216-KIT = smd 1.9 x 1.6: A 1.65,0; C -1.65,0
0603-CAP = smd 1.1 x 1: 1 -0.85,0; 2 0.85,0
LED-0603 = smd 1 x 1: A -0.877,0; C 0.877,0
SOT23-5L = smd 0.6 x 1.2: 1 -0.95,-1.15; 2 0,-1.15; 3 0.95,-1.15; 4 0.95,1.15; 5 -0.95,1.15
SO08 = smd 0.6 x 2.2: 1 -1.905,-2.6; 2 -0.635,-2.6; 3 0.635,-2.6; 4 1.905,-2.6; 5 1.905,2.6; 6 0.635,2.6; 7 -0.635,2.6; 8 -1.905,2.6
1X04 = drill 1.016 long: 1 -3.81,0; 2 -1.27,0; 3 1.27,0; 4 3.81,0
F6035AP = drill 0.7 pad 1.2: 1 0,0.95; 2 0,-0.95
0603 = smd 1.1 x 1: 1 -0.85,0; 2 0.85,0
0603-RES = smd 1.1 x 1: 1 -0.85,0; 2 0.85,0
TRIMPOT_TC33 = smd 1.1 x 0.9: 1 -0.91,-1.45; 2 0,1.45; 3 0.91,-1.45
TACTILE_SWITCH_SMD = smd 1.524 x 0.762: 1 -2.54,1.905; 2 2.54,1.905; 3 -2.54,-1.905; 4 2.54,-1.905
TF-PULL = smd 0.7 x 1.4: 1 -2.2,-7.62; 2 -1.1,-7.62; 3 0,-7.62; 4 1.1,-7.62; 5 2.2,-7.62; 6 3.3,-7.62; 7 4.4,-7.62; 8 5.5,-7.62; 9 6.6,-7.62 | smd 1.4 x 2: S1 -7.9,2.85; S2 7.9,2.85 | smd 1.28 x 1.4: S3 7.96,-6.75 | smd 1.95 x 1.4: S4 -7.025,-6.75 | hole 1.25: -3.1,3.25; 4.9,3.25
SW6-2.54-SMD-7.0X3.5X1.5MM = smd 1.27 x 0.635: CH1A -3.175,2.54; CH1B -3.175,-2.54; CH2A 3.175,2.54; CH2B 3.175,-2.54; COM1 -3.175,0; COM2 3.175,0 | hole 0.813: 0,1.524; 0,-1.524
TSSOP-8 = smd 0.3 x 0.75: 1 -0.975,-2.925; 2 -0.325,-2.925; 3 0.325,-2.925; 4 0.975,-2.925; 5 0.975,2.925; 6 0.325,2.925; 7 -0.325,2.925; 8 -0.975,2.925
TSSOP14-0.65-5X4.4MM = smd 0.4 x 1.2: 1 -2,-2.925; 2 -1.3,-2.925; 3 -0.65,-2.925; 4 0,-2.925; 5 0.65,-2.925; 6 1.3,-2.925; 7 2,-2.925; 8 2,2.925; 9 1.3,2.925; 10 0.65,2.925; 11 0,2.925; 12 -0.65,2.925; 13 -1.3,2.925; 14 -2,2.925
USB-MICRO-SMD = smd 1.4 x 0.4: D+1 2.7,0; D-1 2.7,0.65; GND1 2.7,-1.3; ID1 2.7,-0.65; VBUS1 2.7,1.3 | smd 1.778 x 11.684: GND 0,0 | hole 0.85: 2.2,1.9; 2.2,-1.9
TQFP64 = smd 1.2 x 0.3: 1 -5.7,3.75; 2 -5.7,3.25; 3 -5.7,2.75; 4 -5.7,2.25; 5 -5.7,1.75; 6 -5.7,1.25; 7 -5.7,0.75; 8 -5.7,0.25; 9 -5.7,-0.25; 10 -5.7,-0.75; 11 -5.7,-1.25; 12 -5.7,-1.75; 13 -5.7,-2.25; 14 -5.7,-2.75; 15 -5.7,-3.25; 16 -5.7,-3.75; 33 5.7,-3.75; 34 5.7,-3.25; 35 5.7,-2.75; 36 5.7,-2.25; 37 5.7,-1.75; 38 5.7,-1.25; 39 5.7,-0.75; 40 5.7,-0.25; 41 5.7,0.25; 42 5.7,0.75; 43 5.7,1.25; 44 5.7,1.75; 45 5.7,2.25; 46 5.7,2.75; 47 5.7,3.25; 48 5.7,3.75 | smd 0.3 x 1.2: 17 -3.75,-5.7; 18 -3.25,-5.7; 19 -2.75,-5.7; 20 -2.25,-5.7; 21 -1.75,-5.7; 22 -1.25,-5.7; 23 -0.75,-5.7; 24 -0.25,-5.7; 25 0.25,-5.7; 26 0.75,-5.7; 27 1.25,-5.7; 28 1.75,-5.7; 29 2.25,-5.7; 30 2.75,-5.7; 31 3.25,-5.7; 32 3.75,-5.7; 49 3.75,5.7; 50 3.25,5.7; 51 2.75,5.7; 52 2.25,5.7; 53 1.75,5.7; 54 1.25,5.7; 55 0.75,5.7; 56 0.25,5.7; 57 -0.25,5.7; 58 -0.75,5.7; 59 -1.25,5.7; 60 -1.75,5.7; 61 -2.25,5.7; 62 -2.75,5.7; 63 -3.25,5.7; 64 -3.75,5.7
32.768KHZ-FC-135 = smd 1.3 x 1.8: 1 0,0; 2 2.5,0
FCM1608KF-601T03 = smd 0.6 x 0.8: 1 -0.05,0.4; 2 1.65,0.4
SOT23-8 = smd 0.42 x 0.835: 1 -1.905,-2.58; 2 -0.635,-2.58; 3 0.635,-2.58; 4 1.905,-2.58; 5 1.905,2.58; 6 0.635,2.58; 7 -0.635,2.58; 8 -1.905,2.58
SOT23-6 = smd 0.4 x 0.55: 1 -0.95,-1.15; 2 0,-1.15; 3 0.95,-1.15 | smd 0.55 x 0.55: 4 0.95,1.15; 5 0,1.15; 6 -0.95,1.15
NX5032CA-8MHZ = smd 1.7 x 2: 1 0,0; 2 3.7,0
PJ-327A = smd 1.93 x 3.81: 2 9.1,-6.8; 3 2.1,-6.8; 4 1.1,1.5; 5 4.7,1.5; 6 10.7,1.5
ER-OLED0.96 = smd 0.4 x 4: P$1 0.85,2; P$2 1.55,2; P$3 2.25,2; P$4 2.95,2; P$5 3.65,2; P$6 4.35,2; P$7 5.05,2; P$8 5.75,2; P$9 6.45,2; P$10 7.15,2; P$11 7.85,2; P$12 8.55,2; P$13 9.25,2; P$14 9.95,2; P$15 10.65,2; P$16 11.35,2; P$17 12.05,2; P$18 12.75,2; P$19 13.45,2; P$20 14.15,2; P$21 14.85,2; P$22 15.55,2; P$23 16.25,2; P$24 16.95,2; P$25 17.65,2; P$26 18.35,2; P$27 19.05,2; P$28 19.75,2; P$29 20.45,2; P$30 21.15,2

### Placement (x,y rotation side)
ASW  60.22,36.33 90 top
BT1  7.63,24.26 0 bottom
C1  9.18,49.14 0 top
C2  49.27,24.02 270 top
C3  43.28,39.09 0 top
C4  45.05,63.02 180 top
C5  44.6,55.35 180 top
C6  17.33,19.02 90 top
C7  17.33,22.4 90 top
C8  17.23,25.58 90 top
C9  17.33,28.96 90 top
C10  20.83,19.04 90 top
C11  20.83,22.32 90 top
C12  20.93,25.5 90 top
C13  21.03,28.98 90 top
C14  60.48,62.68 180 top
C15  49.28,30.03 90 top
C16  33.94,39.77 0 top
C17  38.22,39.69 0 top
C18  40.8,39.19 0 top
C19  33.48,51.39 0 top
C20  37.46,51.29 0 top
C21  38.34,46.29 0 top
C22  49.46,7.73 90 top
C23  24.81,22.8 0 top
C24  45.49,13.7 180 top
C25  17.37,38.4 0 top
C26  82.55,59.6 180 top
C27  67.15,65.35 180 top
C28  67.1,53.95 180 top
C29  64.3,53.95 180 top
C30  79.9,49.65 180 top
C31  66.6,39.25 0 top
C32  81.5,33.25 180 top
C33  12.4,3.3 0 bottom
C34  22.2,3.6 0 bottom
C36  49.34,27.03 270 top
C37  49.42,4.83 90 top
C38  10.9,61.32 0 top
C39  11.06,57.32 0 top
C40  24.38,57.49 180 top
C41  75,33.35 0 top
C42  75.5,46.35 180 top
C43  72.9,46.35 180 top
C44  58.1,46.05 0 top
D1  47.4,37.2 180 top
D2  47.3,38.85 180 top
D5  18.29,67.08 270 top
D6  16.2,67.18 270 top
IC1  34.89,46.32 0 top
IC2  51.62,53.26 0 top
JP1  19.42,13.32 0 top
M1  88.77,59.4 0 top
R1  48.88,31.16 0 bottom
R2  30.97,46.26 0 top
R3  44.21,33.58 0 bottom
R4  44.36,31.08 0 bottom
R5  48.81,33.68 0 bottom
R6  67.1,50.15 90 top
R7  67,60.1 90 top
R8  45.61,50.67 270 top
R9  12.5,7.9 90 bottom
R10  22.2,7.8 90 bottom
R11  53.91,46.19 270 top
R12  74.9,59.4 270 top
R13  78.5,59.5 90 top
R14  70,50.1 270 top
R15  70,53.8 270 top
R16  61.4,50.2 270 top
R17  61.3,53.9 270 top
R18  64.4,50.2 90 top
R19  77.8,49.7 270 top
R20  69.4,40.8 180 top
R21  20.55,37.55 0 top
R22  78.9,46.6 0 top
R23  69.4,38.1 180 top
R24  73,49.7 270 top
R25  75.5,49.7 90 top
R26  18.66,59.48 90 bottom
R27  21.41,59.48 90 bottom
R28  15.96,59.48 90 bottom
R29  24.21,59.48 90 bottom
R30  72,33.2 90 top
R31  78.1,33.2 270 top
R32  48.6,46.1 180 top
R33  52.9,65.8 90 top
R34  52.8,61 90 top
R35  41.6,53.5 270 top
R36  29.25,37.8 0 top
R37  24.85,34.6 180 top
R38  49.3,20.9 180 top
R39  49.25,11 180 top
R40  49.45,14.12 180 top
R41  49.3,17.52 0 top
R49  32.86,11.91 270 top
R50  32.94,7.56 90 top
R51  35.79,9.16 90 top
R52  38.44,9.16 90 top
R53  38.39,5.26 270 top
R54  41.14,11.65 90 top
R55  43.79,9.15 270 top
R56  37.04,1.75 180 top
R57  41.09,7.65 90 top
R58  35.74,5.24 270 top
R59  30.19,5.14 90 top
R60  30.14,9.24 270 top
R61  43.79,5.24 90 top
R62  16.33,50.89 0 top
R63  16.28,62.99 90 top
R64  18.53,63.01 90 top
R65  27.98,57.51 90 top
R66  20.53,50.91 0 top
R67  24.8,31.45 180 top
R68  47.5,36.85 0 bottom
R69  47.5,39.85 0 bottom
S1  12.5,3.5 0 top
S2  18.93,43.9 270 top
S3  22.1,3.5 0 top
SD1  35.94,7.59 180 bottom
SW1  33.97,62.17 180 top
T1  26.55,63.37 0 top
U2  76.79,39.5 180 top
U4  21.66,67.36 270 bottom
U$1  35.61,25.11 270 top
U$2  43.27,36.39 180 top
U$3  17.53,30.9 90 top
U$4  28.85,49.5 0 top
U$5  16.39,63.47 270 bottom
U$6  17.6,56.15 0 top
U$7  24.49,53.81 0 top
U$8  37.92,36.12 180 top
U$9  1.47,28.45 0 top
U$18  53.95,27.54 270 top

### Tracks (layer width: path | path; a pad name or v marks a point on that pad's centre or on a via)
B1  (via drill 0.61)
  Top 0.254: S1.1 10,5.38 v12.5,5.38 15,5.38 S1.2 | v18.62,17.38 28.38,17.38 28.62,17.12 33.62,17.12 34.12,17.62 34.12,18.38 33.88,18.62 33.88,19.38 U$1.37
  Bottom 0.254: C33.1 12.5,4.12 v12.5,5.38 R9.1 12.5,7.12 11.62,8 11.62,17.38 v18.62,17.38
B2  (via drill 0.61)
  Top 0.254: 22.12,5.38 24.62,5.38 S3.2 | 22.12,5.38 19.62,5.38 S3.1 | v26.62,20.62 30,20.62 30.25,20.88 33.62,20.88 34.38,20.12 34.38,19.5 U$1.38 | v22.12,5.62 22.12,5.38
  Bottom 0.254: 22.25,5.62 22.25,6.88 R10.1 24.38,9.12 24.38,18.38 v26.62,20.62 | 22.25,5.62 22.25,4.38 C34.1 | v22.12,5.62 22.25,5.62
BOOT0  (via drill 0.61)
  Top 0.254: v45.25,24.75 43.12,26.88 41.38,26.88 U$1.60
  Bottom 0.254: R5.2 48,33.62 48,31.25 R1.2 48,31.12 48,27.5 v45.25,24.75
BOOT1  (via drill 0.61)
  Top 0.254: v31.25,24.88 31.25,23.88 30.75,23.38 30,23.38 U$1.28 | v33,26.62 34,26.62 34.25,26.88 37.62,26.88 v38.62,25.88
  Bottom 0.254: R3.2 43.38,33.5 43.38,31.25 43.5,31.12 R4.2 43.62,31 44.12,30.5 44.12,24.5 40,24.5 v38.62,25.88 | v33,26.62 v31.25,24.88
DAC1  (via drill 0.61)
  Top 0.254: v22.62,34.62 24,34.62 R37.2 | v61.62,36.88 62.75,35.75 63,35.75 ASW.4
  Bottom 0.254: v22.62,34.62 24.88,36.88 24.88,41.62 27,43.75 27,48.38 43.38,64.75 57.25,64.75 57.25,41.25 v61.62,36.88
DAC2  (via drill 0.61)
  Top 0.254: R67.2 24.88,32.38 v33.88,32.38 | v54.62,29.5 v51.62,29.5 | v61.62,34.25 62.88,34.25 63,34.38 ASW.3
  Bottom 0.254: v33.88,32.38 37.12,29.12 37.12,26.12 39.38,23.88 51.62,23.88 v51.62,29.5 | v54.62,29.5 58.88,33.75 61.62,33.75 v61.62,34.25
GND  (via drill 0.61)
  Top 0.254: C25.1 17.38,39.25 18.75,39.25 20.75,41.25 S2.2 20.88,41.38 20.88,46.38 S2.1 20.75,46.5 20.75,49.88 19.75,50.88 R66.1 19.62,51 18.25,52.38 18.25,53.5 U$6.3 18.12,53.62 17.38,54.38 16.5,54.38 U$6.1 15.62,53.5 15.62,51.12 15.5,51 R62.1 15.5,51.25 9.5,57.25 C39.C 9.38,57.38 9.38,59.75 | 9.38,59.75 9.38,61.12 9.25,61.25 C38.C | C21.1 38.25,47.12 38.25,51.25 37.5,52 C20.1 | 34.88,52.12 37.38,52.12 C20.1 | 34.88,52.12 33.5,52.12 C19.1 | 34.88,52.12 34.88,45.25 IC1.2 | T1.7 26.25,66.38 26.88,66.38 T1.6 26.88,66.75 27.25,67.12 v28.25,67.12 39.25,67.12 43.25,63.12 C4.- 43.25,63 37.38,57.12 37.38,52.25 C20.1 | v10.62,59.75 9.38,59.75 | C16.1 34,40.5 38.12,40.5 C17.1 38.25,40.38 40.38,40.38 40.75,40 C18.1 40.88,39.88 43.25,39.88 C3.1 | v44.5,38.62 43.38,39.75 C3.1 | 51.75,52.12 52.75,52.12 53.5,51.38 53.5,50.75 IC2.4 53.62,51.38 58,51.38 61.25,54.62 R17.1 62.5,54.75 66.25,58.5 | 51.75,52.12 51,51.38 51,50.75 IC2.2 50.88,50.62 50.88,49.5 47.75,46.38 R32.2 47.75,46 45.56,43.81 | v85.12,59.75 84.25,58.88 82.62,58.88 C26.1 | R7.1 66.25,58.5 | 66.25,58.5 68.19,56.56 | 68.19,56.56 70,54.75 R15.1 | 68.19,56.56 v71.38,59.75 | 45.56,43.81 43.5,41.75 43.5,41.12 43.25,40.88 43.25,40 C3.1 | 51.75,52.12 v51.75,52.5 | 13.62,1.62 15,1.62 S1.4 15.12,1.62 16.25,1.62 | 13.62,1.62 10,1.62 S1.3 | 16.25,1.62 19.5,1.62 S3.3 19.62,1.62 24.62,1.62 S3.4 | JP1.4 23.25,13.38 v27.25,13.38 30.12,13.38 31.38,14.62 43.75,14.62 45.38,13 C24.1 45.5,12.88 46.38,12.88 48.25,11 R39.2 | v13.62,2.5 13.62,1.62 | 3.5,25.38 3.5,29 2.62,29.88 U$9.4 | 3.5,25.38 3.5,21.75 U$9.3 | 33.88,29.75 32.5,28.38 30,28.38 U$1.18 29.88,28.38 27.38,28.38 27,28.75 26.25,28.75 24,26.5 24,23.5
  Top 0.254: 33.88,29.75 33.88,30.75 U$1.12 | U$1.63 41.25,28.38 35.38,28.38 34,29.75 33.88,29.75 | C8.1 16.5,25.5 16.5,22.5 C7.1 16.62,22.38 16.62,19.12 C6.1 16.5,19 14.5,17 14.5,12 16.25,10.25 16.25,1.62 | 16.5,27.25 16.5,25.62 C8.1 | 16.5,27.25 16.5,28.88 C9.1 | C10.1 20.12,19.12 20.12,22.25 C11.1 20.12,22.38 21.25,23.5 22.12,23.5 | 22.12,23.5 24,23.5 | 24,23.5 24.75,23.5 C23.1 | 22.12,23.5 22.12,23.62 20.25,25.5 C12.1 20.25,25.62 20.25,27.25 | 20.25,27.25 20.25,28.88 C13.1 | 20.25,27.25 16.5,27.25 | 3.5,25.38 16.38,25.38 C8.1 | U$18.P$13 56,18.38 56,18.88 U$18.P$12 | 53.56,22.19 53.88,21.88 55.88,21.88 U$18.P$8 | 53.56,22.19 51.75,24 50.12,24 C2.1 | 53.56,20.69 53.5,20.75 53.5,22.12 53.56,22.19 | 53.56,20.69 53.75,20.5 55.88,20.5 U$18.P$10 | 53.56,19.31 53.5,19.38 53.5,20.62 53.56,20.69 | 53.56,19.31 53.88,19 55.88,19 U$18.P$12 | 53.56,19.31 53.5,19.25 53.5,17.25 53.75,17 55.88,17 U$18.P$15 56,16.88 56,16.25 U$18.P$16 56,16.12 56,15.5 U$18.P$17 56.12,15.5 58,15.5 58.38,15.12 58.38,9.5 | 48.62,6 48.62,7.62 C22.1 48.62,7.75 48.62,10.62 48.38,10.88 R39.2 | 48.62,6 48.62,4.88 C37.1 | U$18.P$25 56,10 56,10.5 U$18.P$24 56,10.62 56,11.25 U$18.P$23 56,11.38 56.25,11.62 | 58.38,9.5 58.38,7.5 58,7.12 56,7.12 U$18.P$29 | 56.25,11.62 56,11.88 U$18.P$22 | 56.25,11.62 58.38,9.5 | U$18.P$21 56,12.62 56,12 U$18.P$22 | R39.2 48.5,11 49.38,11.88 55.88,11.88 U$18.P$22 | v48.5,6 48.62,6 | C32.2 81.5,34.12 79.62,34.12 78.12,35.62 77,35.62 76.88,35.75 76.88,36.5 U2.11 76.75,36.62 76.75,37.25 75.94,38.06 | 75.94,38.06 74.25,39.75 74.25,45.75 75.5,47 C42.2 | 75.94,38.06 78.06,40.19 | 78.06,40.19 80.75,42.88 80.75,49.38 80,50.12 80,50.38 C30.2
  Top 0.254: C31.1 66.5,40.12 63.88,40.12 63.12,40.88 ASW.8 63,40.75 61.75,40.75 60.31,39.31 | v52,33.5 57.12,33.5 57.38,33.25 ASW.15 57.5,33.25 58.31,32.44 | 58.88,32 58.75,32 58.31,32.44 | 58.88,32 63,32 ASW.1 63.12,31.88 63.62,31.38 81.75,31.38 82.88,32.5 82.88,35.38 78.06,40.19 | 60.31,39.31 58.38,37.38 58.38,32.5 58.31,32.44 | 58.88,32 58.88,19.88 57.88,18.88 56.12,18.88 U$18.P$12 | 45.56,43.81 48.88,40.5 55.75,40.5 56.75,41.5 58.12,41.5 60.31,39.31
  Bottom 0.254: U4.GND1 22.96,66.06 U4.GND | v28.25,67.12 23.25,67.12 22.62,66.5 U4.GND | v10.62,59.75 18.12,67.25 21.62,67.25 U4.GND | v44.5,38.62 44.5,34.12 45,33.62 R3.1 | M1.1 88.75,60.25 88.75,59.75 v85.12,59.75 v71.38,59.75 | v51.75,52.5 51.75,64.25 46.38,64.25 45.62,63.5 45.62,63.12 43.38,63.12 C4.- | 13.62,2.62 22.12,2.62 22.12,2.75 C34.2 22.25,2.88 28,2.88 28,4.62 SD1.S1 28.12,4.75 28.12,13.38 | 13.62,2.62 12.5,2.62 C33.2 | 28.12,13.38 28.12,13.5 28.88,14.25 SD1.S4 | 28.12,13.38 v27.25,13.38 | v13.62,2.5 13.62,2.62 | SD1.S3 43.88,14.38 43.38,14.88 43.38,16.25 39.75,16.25 39.62,16.12 39.62,15.62 39.25,15.25 SD1.6 39.12,15.12 39.12,11.12 38.5,10.5 38.5,6.12 42.38,6.12 43.75,4.75 SD1.S2 43.88,4.75 45.12,6 v48.5,6 | v52,33.5 52,33.62 49.75,33.62 R5.1
  pour Top: -2.5,72.6 96.2,72.6 96.2,-2.6 -2.5,-2.6
  pour Bottom: -2.5,73 96.2,73 96.2,-2.8 -2.5,-2.8
HEART_SOUND  (via drill 0.61)
  Top 0.254: 75.25,42.38 75.38,42.38 U2.6 | 75.25,42.38 74.88,42.38 U2.7 | 73,43.75 73,40.38 73.5,39.88 73.5,39.12 71.62,37.25 64.12,37.25 63.12,38.25 ASW.6 | 73,43.75 73,45.5 C43.1 | v75.25,43.75 75.25,42.38 | v73.12,43.75 73,43.75
  Bottom 0.254: v73.12,43.75 v75.25,43.75
I2C1_SCL  (via drill 0.61)
  Top 0.254: U$18.P$18 55.88,14.75 55.12,14.75 55,14.88 53.88,14.88 53.25,15.5 53.25,16.12 51.88,17.5 50.25,17.5 R41.2 50.12,17.5 49.62,17.5 49.62,16.5 49.5,16.38 47.38,16.38 46.25,17.5 46.25,20.38 46.12,20.5 46.12,25.12 v43.25,28 | v39.88,25.88 41.25,25.88 U$1.58 | v40.88,29.75 41,29.62 42.38,29.62 v42.62,29.88
  Bottom 0.254: v39.88,25.88 40.25,25.88 40.88,26.5 v40.88,29.75 | v42.62,29.88 43.25,29.25 v43.25,28
I2C1_SDA  (via drill 0.61)
  Top 0.254: v44.5,22.25 44.38,22.38 44.38,24.88 42.88,26.38 41.38,26.38 U$1.59 | v47.62,12.88 49.12,12.88 50.25,14 R40.1 50.38,14.12 55.88,14.12 U$18.P$19 56,14 56,13.5 U$18.P$20
  Bottom 0.254: v44.5,22.25 48,18.75 48,13.25 v47.62,12.88
IN1  (via drill 0.61)
  Top 0.254: v41.75,31 42.5,31 44.25,32.75 44.25,35.25 44.75,35.75 45.5,35.75 45.88,35.38 47,35.38 47.88,34.5 51.38,34.5 51.5,34.38 57.38,34.38 ASW.14 | v42.62,25.38 41.38,25.38 U$1.57
  Bottom 0.254: v41.75,31 41.75,26.25 v42.62,25.38
IN2  (via drill 0.61)
  Top 0.254: v38,29.38 38.25,29.38 38.88,30 38.88,30.75 U$1.2 | v54.25,41.38 v52,41.38 | v60,34.62 61.38,33.25 63,33.25 ASW.2
  Bottom 0.254: v38,29.38 37.88,29.5 37.88,52.38 37.38,52.88 37.38,53.62 37.88,54.12 46.62,54.12 46.62,46.75 v52,41.38 | v54.25,41.38 60,35.62 v60,34.62
LUNG_SOUND  (via drill 0.61)
  Top 0.254: U2.13 78.12,36.62 78.75,36.62 U2.14 78.88,36.5 v79.75,36.5 | ASW.5 63.12,36.88 63.25,36.75 71.5,36.75 74.12,34.12 75,34.12 C41.1 74.88,34 75.25,33.62 v76.88,33.62
  Bottom 0.254: v76.88,33.62 v79.75,36.5
MCU_3V3  (via drill 0.61)
  Top 0.254: v45.38,16.75 47.56,14.56 | 47.56,14.56 48,14.12 48.5,14.12 R40.2 | v39.38,18 39.38,19.38 U$1.48 | R57.2 41.38,8.5 43.75,6.12 R61.2 43.75,6 42.62,4.88 42.62,3.5 41.62,2.5 38.75,2.5 38.62,2.62 36.12,2.62 | 36.12,2.62 36.12,4 35.75,4.38 R58.2 35.75,4.5 v37,5.75 | 36.12,2.62 36.12,1.75 R56.2 36.12,1.62 31.25,1.62 29.25,3.62 29.25,5 30.12,5.88 R59.2 30.25,6 30.25,8.38 R60.2 30.12,8.5 20.62,8.5 15.75,13.38 JP1.1 15.62,13.38 15.62,15.62 18,18 18,19 C6.2 18.12,19.12 18.12,22.38 C7.2 18,22.5 18,25.5 C8.2 | C9.2 18,29 17.25,29.75 17.25,30.75 U$3.1 17.12,30.88 16.38,31.62 16.38,33 16.62,33.25 18.25,33.25 18.56,33.56 | 21.38,36.88 21.38,36.38 18.56,33.56 | 21.38,36.88 21.38,37.5 R21.2 | R2.1 30,46.25 29.5,46.25 23,39.75 23,38.38 21.5,36.88 21.38,36.88 | v26.62,22.88 28.25,21.25 29.88,21.25 U$1.32 | v24.88,24.75 25,24.62 v26.62,24.62 v28.38,24.62 | v31.25,27.5 30.88,27.88 30,27.88 U$1.19 | v21.88,30.25 18.56,33.56 | U$1.64 41.25,28.88 40.5,28.88 39.38,30 39.38,30.75 U$1.1 39.38,30.88 v42,33.5 | 47.12,30.75 47.12,20.62 48.38,19.38 48.38,17.62 R41.1 48.25,17.88 v47.12,17.88 | 47.12,30.75 48.25,31.88 49.75,31.88 | 49.75,31.88 57.38,31.88 ASW.16 | 49.75,31.88 v49.75,32.38 | v46.75,31 47,30.75 47.12,30.75 | 63.56,48.19 64.12,47.62 68.38,47.62 R14.2 69.75,48.88 71.62,48.88 | 63.56,48.19 62.5,49.25 61.5,49.25 R16.2 | 72.31,56.69 71.62,56 71.62,50.62 72.12,50.12 72.12,49.38 71.62,48.88 | 72.31,56.69 74.12,58.5 74.88,58.5 R12.2 | R33.2 53,66.75 66.38,66.75 66.62,67 67.62,67 72.25,62.38 72.25,56.75 72.31,56.69 | v76.75,41 76.75,42.38 U2.4 | 71.62,48.88 v71.62,48.12 | v48.75,41.88 51.25,41.88 52,42.62 58,42.62 63.56,48.19
  Top 0.254: v47.12,14.12 47.56,14.56
  Bottom 0.254: v45.38,16.75 41.12,21 38.25,21 38.25,18 | 38.25,18 38.25,16.75 37.75,16.25 37.12,16.25 37.12,15.25 SD1.4 37,15.12 v37,5.75 | 38.25,18 v39.38,18 | JP1.1 15.5,13.25 15.5,11.75 R9.2 22.12,8.75 R10.2 22.12,8.88 22.12,16.88 24.5,19.25 24.5,24.38 v24.88,24.75 24.88,27.25 v21.88,30.25 | v26.62,24.62 v26.62,22.88 | v28.38,24.62 v31.25,27.5 | 45.88,31.75 45.25,31.12 R4.1 | 45.88,31.75 45.88,32.88 46.25,33.25 46.25,36.38 46.62,36.75 R68.2 46.62,36.88 46.62,39.75 R69.2 | v42,33.5 42.38,33.88 42.38,37.75 44.12,39.5 46.5,39.5 R69.2 | v49.75,32.38 49.75,31.25 R1.1 | v46.75,31 46,31.75 45.88,31.75 | v76.75,41 73.88,41 73.88,41.75 71.62,44 v71.62,48.12 | v48.75,41.88 46.75,39.88 R69.2 | v47.12,17.88 v47.12,14.12
N$1
  Top 0.254: C26.2 82.5,60.38 78.5,60.38 R13.2 78.5,60.25 R12.1
N$2  (via drill 3)
  other vias: 4.7,6.6
N$3  (via drill 0.61)
  Top 0.254: C29.2 64.38,54.75 67,54.75 C28.2 67.12,54.75 v68.75,54.75 | v81.38,58.88 81.25,58.75 78.5,58.75 R13.1
  Bottom 0.254: M1.2 88.75,58.5 88.75,58.88 v81.38,58.88 72.88,58.88 v68.75,54.75
N$4
  Top 0.254: 21.94,54.69 22.38,54.25 27.12,54.25 28.88,56 28.88,57.38 | 21.94,54.69 19.62,57 19.62,58.62 U$6.5 | 28.88,57.38 28,58.25 R65.2 | 28.88,57.38 33,57.38 37.12,61.5 37.12,62.12 SW1.COM1 | 14.25,57.25 15.5,57.25 18.38,54.38 18.62,54.38 18.88,54.12 18.88,53 19.12,52.75 20,52.75 21.94,54.69 | 14.25,57.25 12.75,57.25 C39.A | C1.+ 7.5,49.25 7.5,61.88 8.12,62.5 10.38,62.5 11.25,61.62 11.25,60.38 14.25,57.38 14.25,57.25
  Bottom 0.254: C1.+ 7.38,49.12 5.25,47 5.25,38.88 BT1.+
N$5  (via drill 3)
  other vias: 87.2,47.1
N$6  (via drill 0.61)
  Top 0.254: R6.1 67.12,49.38 68.5,49.38 70,50.88 R14.1 | R14.1 R15.2 | v77,44 77.38,43.62 77.38,42.5 U2.3 | v71.25,49.75 70.12,50.88 R14.1
  Bottom 0.254: v71.25,49.75 v77,44
N$7  (via drill 0.61)
  Top 0.254: v31.62,11.12 32.75,11.12 R49.2
  Bottom 0.254: v31.62,11.12 33.62,13.12 33.62,15.12 SD1.1
N$8  (via drill 0.61)
  Top 0.254: C2.2 48.5,24 48.5,21 R38.2 48.5,20.88 v50.62,18.75 | v58.75,18.38 58,17.62 56,17.62 U$18.P$14
  Bottom 0.254: v50.62,18.75 58.75,18.75 v58.75,18.38
N$9
  Top 0.254: C15.1 48.62,30 51.12,27.5 51.62,27.5 53.75,25.38 55.88,25.38 U$18.P$3
N$10  (via drill 0.61)
  Top 0.254: R17.2 61.38,53 61.38,51.12 R16.1 61.5,51 63.12,49.38 64.38,49.38 R18.1 65.25,48.5 v65.62,48.5 | v76.12,35.25 76.12,36.5 U2.10
  Bottom 0.254: v76.12,35.25 75.12,36.25 75.12,39 v65.62,48.5
N$11
  Top 0.254: C29.1 64.38,53.12 64.38,51.12 R18.2
N$12
  Top 0.254: C28.1 67.12,53.12 67.12,51 R6.2
N$13
  Top 0.254: R19.2 77.88,48.75 78,48.62 78,46.62 R22.1 78,46.5 78,42.5 U2.2
N$14  (via drill 0.61)
  Top 0.254: R25.2 75.5,50.62 77.75,50.62 R19.1 77.88,50.5 79,49.38 v79,47.88 | v78.88,45.38 78.88,42.5 U2.1
  Bottom 0.254: v78.88,45.38 79,45.5 v79,47.88
N$15
  Top 0.254: C30.1 79.88,48.88 79.88,46.75 79.75,46.62 R22.2
N$16  (via drill 0.61)
  Top 0.254: R23.1 70.25,39.12 69.94,39.44 | 69.94,39.44 68.62,40.75 R20.2 | v74.25,38.5 75.38,37.38 75.38,36.62 U2.9 | v72.62,39.5 70,39.5 69.94,39.44
  Bottom 0.254: v74.25,38.5 72.62,38.5 v72.62,39.5
N$17  (via drill 0.61)
  Top 0.254: v71,35.12 72,34.12 R30.2 | v72.75,36.88 74.5,36.88 74.75,36.62 U2.8 | v71.62,40.75 70.25,40.75 R20.1
  Bottom 0.254: v72.75,36.88 71.81,35.94 | 71.81,35.94 v71,35.12 | v71.62,40.75 71.75,40.62 71.75,36 71.81,35.94
N$18
  Top 0.254: C20.2 37.38,50.5 37.38,49 35.88,47.5 IC1.4
N$19
  Top 0.254: C31.2 66.62,38.38 68.25,38.38 68.5,38.12 R23.2
N$20
  Top 0.254: C43.2 73,47.12 R24.2 73.12,48.88 75.5,48.88 R25.1
N$21  (via drill 0.61)
  Top 0.254: U2.5 76.12,42.5 76.12,44.12 75.5,44.75 C42.1 75.62,45.5 v76.62,46.5 | v74.25,49.75 73.5,50.5 73,50.5 R24.1
  Bottom 0.254: v74.25,49.75 76.62,47.38 v76.62,46.5
N$22  (via drill 0.61)
  Top 0.254: v32.5,35.38 30.12,37.75 R36.2 | v33.38,33.62 33.88,33.62 35.88,31.62 35.88,30.88 U$1.8
  Bottom 0.254: v32.5,35.38 33.38,34.5 v33.38,33.62
N$23
  Top 0.254: R30.1 72,32.38 72.12,32.5 75,32.5 C41.2 75,32.38 78,32.38 R31.2
N$24
  Top 0.254: R31.1 78.12,34 79.62,32.5 C32.1 81.5,32.62 82.38,33.5 82.38,35.12 79.88,37.62 77.75,37.62 77.5,37.38 77.5,36.62 U2.12
N$25
  Bottom 0.254: U4.D-1 21.01,62.68 R26.2
N$26
  Top 0.254: C23.2 24.88,22.12 25.75,23 25.75,23.25 26.25,23.75 27.25,23.75 29.12,21.88 29.88,21.88 U$1.31
N$27  (via drill 0.61)
  Top 0.254: v44.5,15.88 45.38,15 45.38,14.5 C24.2 | v40.25,20.12 39.88,20.12 39.62,20.38 39,20.38 38.88,20.25 38.88,19.5 U$1.47
  Bottom 0.254: v40.25,20.12 v44.5,15.88
N$28  (via drill 0.61)
  Top 0.254: v26.75,33.5 25.75,34.5 R37.1 | v26.62,27.88 28.62,27.88 29.12,27.38 29.88,27.38 U$1.20
  Bottom 0.254: v26.75,33.5 26.62,33.38 v26.62,27.88
N$29  (via drill 0.61)
  Top 0.254: S2.3 17.12,46.38 17.12,41.38 S2.4 17,41.25 17,40.12 16.5,39.62 16.5,38.5 17.25,37.75 C25.2 17.38,37.62 19.62,37.62 R21.1 19.75,37.62 20.88,38.75 v22.12,38.75 | v23.88,38 27.38,34.5 33.75,34.5 36.38,31.88 36.38,30.88 U$1.7
  Bottom 0.254: v23.88,38 22.12,38 v22.12,38.75
N$30
  Top 0.254: IC1.5 33.88,47.5 33.5,47.88 33.5,50.62 C19.2 33.38,50.75 30.12,50.75 29.75,50.38 29.75,49.12 31.75,47.12 31.75,46.38 R2.2
N$31
  Bottom 0.254: U4.D+1 21.66,60.58 R27.2
N$32
  Bottom 0.254: U4.VBUS1 17.13,64.66 U$5.1
N$33
  Bottom 0.254: U4.ID1 22.31,62.23 R29.2
N$34
  Bottom 0.254: U$5.2 16,61.75 16,60.38 R28.2
N$35
  Top 0.254: R32.1 49.5,46.12 51.5,46.12 52.38,47 R11.1 52.38,47.12 52.38,50.62 IC2.3
N$36
  Top 0.254: C44.1 58,46.75 55.88,46.75 55.38,46.25 R11.2
N$37  (via drill 0.61)
  Top 0.254: v50.88,59 50.88,55.88 IC2.7
  Bottom 0.254: v50.88,59 46.88,63 C4.+
N$38
  Top 0.254: C27.2 67.12,66 65.62,66 62.38,62.75 C14.+ 62.25,62.62 55.5,55.88 53.62,55.88 IC2.5
N$39
  Top 0.254: C36.1 50.12,27 51.25,27 53.5,24.75 53.5,24.25 53.75,24 55.88,24 U$18.P$5
N$40
  Top 0.254: C15.2 50.12,30 50.12,29.75 53.88,26 55.88,26 U$18.P$2
N$41
  Top 0.254: C36.2 48.5,27.12 48.5,28.75 47.62,29.62 47.62,30.5 48,30.88 54.5,30.88 58.38,27 58.38,25 58,24.62 56,24.62 U$18.P$4
N$42  (via drill 0.61)
  Top 0.254: v51.75,11 R39.1 | v53.12,9.62 53.5,9.62 53.88,9.25 55.88,9.25 U$18.P$26
  Bottom 0.254: v53.12,9.62 v51.75,11
N$43
  Top 0.254: C22.2 50.25,7.75 53.12,7.75 53.75,8.38 55.88,8.38 U$18.P$27
N$44
  Top 0.254: C37.2 50.25,4.88 51,4.88 53.88,7.75 55.88,7.75 U$18.P$28
N$45
  Top 0.254: C27.1 67.12,64.5 67.12,61.12 67,61 R7.2
N$46
  Top 0.254: C5.2 44.62,56 49.5,56 49.62,55.88 IC2.8
N$47  (via drill 3)
  other vias: 3.9,60.6
N$48  (via drill 3)
  other vias: 63.4,3.5
N$51  (via drill 0.61)
  Top 0.254: v33,9.75 33,8.5 R50.2
  Bottom 0.254: v33,9.75 34.75,11.5 34.75,15.12 SD1.2
N$52  (via drill 0.61)
  Top 0.254: v35.88,12.88 35.88,10.12 R51.2
  Bottom 0.254: v35.88,12.88 35.88,15.12 SD1.3
N$53  (via drill 0.61)
  Top 0.254: v38.12,11.38 38.38,11.12 38.38,10.12 R52.2
  Bottom 0.254: v38.12,11.38 38.12,15.12 SD1.5
N$54  (via drill 0.61)
  Top 0.254: v39.88,7.5 38.5,6.12 R53.1
  Bottom 0.254: v39.88,7.5 40.5,8.12 40.5,15 40.38,15.12 SD1.7
N$55  (via drill 0.61)
  Top 0.254: v42.38,12.5 R54.2
  Bottom 0.254: v42.38,12.5 41.5,13.38 41.5,15.12 SD1.8
N$56  (via drill 0.61)
  Top 0.254: v43.75,12.62 43.75,10 R55.1
  Bottom 0.254: v43.75,12.62 42.75,13.62 42.75,15 SD1.9
N$57
  Top 0.254: C5.1 44.5,54.5 41.75,54.5 R35.1 40.75,53.5 40.75,51.88 41,51.62 44.12,51.62 R8.1
N$58
  Top 0.254: U$6.2 17,53.5 17,51.12 17.12,51 R62.2
N$59
  Top 0.254: U$6.7 16.88,58.75 16.88,61.62 16.38,62.12 R63.1
N$60
  Top 0.254: U$6.6 18.25,58.75 18.25,61.88 18.5,62.12 R64.1
N$61
  Top 0.254: D6.C 16.25,66.25 16.25,63.88 R63.2
N$62
  Top 0.254: D5.C 18.25,66.12 18.25,65.62 18.12,65.5 18.12,64.25 18.5,63.88 R64.2
N$63
  Top 0.254: R35.2 41.62,52.62 45.12,52.62 47,50.75 R8.2 47.12,50.62 49.62,50.62 IC2.1
N$64  (via drill 0.61)
  Top 0.254: v20,36.25 18.5,36.25 12.25,30 U$9.6 12.12,30 6.25,30 U$9.5 6.12,30 3.88,32.25 1.5,32.25 1.25,32 1.25,20.62 2.5,19.38 4.75,19.38 7,21.62 10.5,21.62 U$9.2
  Bottom 0.254: v20,36.25 20,42.12 35.62,57.75 35.62,65.25 57.5,65.25 57.75,65 57.75,63.62 58.62,62.75 C14.-
N$65
  Top 0.254: 24.5,56.75 24.5,55 U$7.5 | 24.5,56.75 25.12,57.38 C40.1 | 24.5,56.75 27.88,56.75 R65.1
N$66  (via drill 0.61)
  Top 0.254: T1.3 26.88,60.5 26.25,60.5 T1.2 26.12,60.38 26.12,60 24.31,58.19 | U$7.6 23.62,55 23.62,57.38 C40.2 23.62,57.5 24.31,58.19 | v19.75,62.75 24.31,58.19
  Bottom 0.254: BT1.- 10.25,38.88 10.25,48.5 10.88,49.12 C1.- 11,49.25 16.88,55.12 16.88,62.75 v19.75,62.75
N$67  (via drill 0.61)
  Top 0.254: v27.88,53.75 24.62,53.75 23.62,52.75 U$7.1 | v28.25,59.62 27.5,60.38 T1.4
  Bottom 0.254: v27.88,53.75 28.25,54.12 v28.25,59.62
N$68
  Top 0.254: U$7.2 24.38,52.62 24.12,52.38 24.12,52.25 22.88,51 21.5,51 R66.2
N$69
  Top 0.254: T1.1 25.62,60.5 25.62,66.25 T1.8
N$70  (via drill 0.61)
  Top 0.254: v26.38,52.75 25.5,52.75 U$7.3 | v26.75,65.12 27.5,65.88 27.5,66.25 T1.5
  Bottom 0.254: v26.38,52.75 26.75,53.12 v26.75,65.12
N$71  (via drill 0.61)
  Top 0.254: v28.38,30.5 27.38,31.5 25.75,31.5 R67.1 | v28.38,26.88 29.88,26.88 U$1.21
  Bottom 0.254: v28.38,26.88 v28.38,30.5
N$72
  Top 0.254: IC2.6 52.38,55.88 52.75,56.25 52.75,60.12 R34.1 52.88,60.25 53.75,61.12 53.75,62.5 53,63.25 53,64.88 R33.1
N$73
  Top 0.254: U$4.1 28.88,50 28.88,51.38 37.12,59.62 SW1.CH1A
N$74  (via drill 0.61)
  Top 0.254: v44.38,40.88 46.38,38.88 D2.C | v39.88,27.5 40.12,27.5 40.5,27.88 41.25,27.88 U$1.62
  Bottom 0.254: v44.38,40.88 43.25,40.88 43.25,39.88 39.88,36.5 v39.88,27.5
N$75  (via drill 0.61)
  Top 0.254: v48.12,35.62 46.62,37.12 D1.C | v46.75,32.5 46.5,32.5 42.25,28.25 42.25,27.5 42.12,27.38 41.38,27.38 U$1.61
  Bottom 0.254: v48.12,35.62 46.75,34.25 v46.75,32.5
N$76  (via drill 0.61)
  Top 0.254: v49.62,37.12 48.38,37.12 D1.A
  Bottom 0.254: v49.62,37.12 48.38,37.12 48.38,36.88 R68.1
N$77  (via drill 0.61)
  Top 0.254: v49.5,38.88 48.25,38.88 D2.A
  Bottom 0.254: v49.5,38.88 48.38,38.88 48.38,39.75 R69.1
OSC32_IN
  Top 0.254: C3.2 43.25,38.25 43.25,36.5 U$2.1 43.25,36.38 43.25,34.88 43.12,34.75 41.38,34.75 40.62,34 38.88,34 38.38,33.5 38.38,30.88 U$1.3
OSC32_OUT
  Top 0.254: C18.2 40.75,38.38 40.75,36.5 U$2.2 40.62,36.5 37.88,33.75 37.88,30.88 U$1.4
OSC_IN
  Top 0.254: C17.2 38.12,38.88 38.12,36.25 38,36.12 U$8.1 37.88,36 37.38,35.5 37.38,30.88 U$1.5
OSC_OUT
  Top 0.254: C16.2 34,39 34,36.25 34.12,36.12 U$8.2 34.25,36 36.88,33.38 36.88,30.88 U$1.6
OTG_FS_DM  (via drill 0.61)
  Top 0.254: v23.62,20.75 24,20.75 26.75,18 v33.25,18 | v37.38,17.12 37.38,19.38 U$1.44
  Bottom 0.254: v23.62,20.75 19.12,25.25 19.12,58.25 18.75,58.62 R26.1 | v33.25,18 34.12,17.12 v37.38,17.12
OTG_FS_DP  (via drill 0.61)
  Top 0.254: v23.38,50.25 25.5,50.25 v27.88,47.88 | v33.75,28.38 33.5,28.38 32.12,27 32.12,23.75 33.5,22.38 34.75,22.38 35.38,21.75 36.75,21.75 37.88,20.62 37.88,19.5 U$1.45
  Bottom 0.254: v23.38,50.25 23.38,56.75 21.5,58.62 R27.1 | v27.88,47.88 28.75,47 28.75,45.5 28.62,45.38 28.62,43.5 31.12,41 31.12,31 v33.75,28.38
OTG_FS_ID  (via drill 0.61)
  Top 0.254: v24.25,49.12 24.25,48.62 26.25,46.62 v27.88,46.62 | v28,16.5 28.12,16.62 32.75,16.62 33.25,16.12 35.12,16.12 36.88,17.88 36.88,19.38 U$1.43
  Bottom 0.254: v24.25,49.12 24.25,58.62 R29.1 | v27.88,46.62 27.88,43.5 28.25,43.12 28.25,32.88 27.5,32.12 27.5,21 28,20.5 v28,16.5
SD_CD  (via drill 0.61)
  Top 0.254: 44.62,7.5 44.62,5.25 43.88,4.5 R61.1 | 44.62,7.5 43.88,8.25 R55.2 | v25.38,20.62 26.25,19.75 29.88,19.75 30.5,20.38 33.12,20.38 33.38,20.12 33.38,19.5 U$1.36 | v29.5,45 v25.75,41.25 | 44.62,7.5 v45.62,7.5
  Bottom 0.254: v25.38,20.62 25.75,21 v25.75,41.25 | v29.5,45 32,47.5 32,49.88 44.12,62 46.12,62 46.12,55.38 53.38,48.12 53.38,22.75 49,18.38 49,10.88 v45.62,7.5
SD_CLK  (via drill 0.61)
  Top 0.254: v39.62,9.12 38.88,8.38 38.5,8.38 R52.1 | v36.62,23.25 40.38,23.25 40.5,23.38 41.25,23.38 U$1.53
  Bottom 0.254: v39.62,9.12 39,8.5 39,7.12 39.5,6.62 41.62,6.62 41.62,9.75 42.12,10.25 45.5,10.25 45.5,10 46,9.5 46.88,9.5 46.88,9.62 48.5,11.25 48.5,19.5 44.75,23.25 v36.62,23.25
SD_CMD  (via drill 0.61)
  Top 0.254: R51.1 35.75,8.25 35.75,6.12 R58.1 35.62,6 34.75,5.12 v34.75,2.5 | v34.62,26 35.12,26 37.25,23.88 41.25,23.88 U$1.54
  Bottom 0.254: v34.62,26 33.88,26.75 33.88,27 33.38,27.5 32.12,27.5 32.12,27 30.25,25.12 30.25,4.38 32.12,2.5 v34.75,2.5
SD_DAT0  (via drill 0.61)
  Top 0.254: R57.1 41,6.75 40.62,6.75 39.25,5.38 39.25,5.25 38.5,4.5 R53.2 38.38,4.5 v37,4.5 | v35,18 34.88,18.12 34.88,19.38 U$1.39
  Bottom 0.254: v35,18 33.88,19.12 33.88,24.5 33.38,25 32.12,25 32.12,23.62 30.75,22.25 30.75,10.75 v37,4.5
SD_DAT1  (via drill 0.61)
  Top 0.254: R56.1 44,1.75 47.38,5.12 47.38,10.62 45.88,12.12 45,12.12 44.62,12.5 44.62,13 44.12,13.5 40.5,13.5 40.25,13.25 | 40.25,13.25 40.25,11.75 41.12,10.88 R54.1 | v31.62,21.88 33.62,21.88 35.38,20.12 35.38,19.5 U$1.40 | v31.75,13.75 39.62,13.75 40.12,13.25 40.25,13.25
  Bottom 0.254: v31.62,21.88 31.75,21.75 v31.75,13.75
SD_DAT2  (via drill 0.61)
  Top 0.254: 31.62,12.25 32.75,12.25 32.88,12.38 32.88,12.75 R49.1 | 31.62,12.25 31,12.25 30.12,11.38 30.12,10.12 R60.1 | v33,24.12 33,23.62 33.62,23 34.88,23 35.5,22.38 41.25,22.38 U$1.51 | v31.62,12.38 31.62,12.25
  Bottom 0.254: v33,24.12 32.62,23.75 32.62,21.62 32.25,21.25 32.25,14.5 32.62,14.12 32.62,13.38 v31.62,12.38
SD_DAT3  (via drill 0.61)
  Top 0.254: 32,6.12 30.25,4.38 R59.1 | 32,6.12 33,6.12 33,6.62 R50.1 | v43.25,22.25 42.62,22.88 41.38,22.88 U$1.52 | v46.38,10.38 46.88,9.88 46.88,8 46.75,7.88 46.75,5.25 46.25,4.75 v45.75,4.75 | v31.62,6.62 32,6.25 32,6.12
  Bottom 0.254: v43.25,22.25 45,20.5 45.25,20.5 45.25,20.38 45.88,19.75 45.88,17.88 46.38,17.38 46.38,14.62 46.25,14.5 46.25,13.75 46.38,13.62 v46.38,10.38 | v45.75,4.75 45.12,4.12 45.12,3 43.38,1.25 36.12,1.25 36.12,4 33.5,6.62 v31.62,6.62
SIGNAL  (via drill 0.61)
  Top 0.254: v61.62,39.38 62.88,39.38 63,39.5 ASW.7 | C44.2 58.12,45.25 v58.12,44 58,44 57.12,43.12 v49,43.12 | v42.62,41.5 32.12,41.5 28.5,37.88 R36.1
  Bottom 0.254: v58.12,44 61.62,40.5 v61.62,39.38 | v42.62,41.5 43.75,41.5 45.38,43.12 v49,43.12
SWTCK
  Top 0.254: JP1.3 20.69,14.19 21.7,15.2 42.6,15.2 45.7,18.3 45.7,20.2 44.6,21.3 41.37,21.3 U$1.49
SWTDIO
  Top 0.254: JP1.2 18.38,13.32 20.72,15.66 38.16,15.66 38.3,15.8 38.3,18.63 38.34,18.67 38.34,19.39 U$1.46
VBUS  (via drill 0.61)
  Top 0.254: 14.81,59.06 12.62,61.25 C38.A 12.62,61.38 12.62,64.25 16.25,67.88 D6.A 16.25,68 18.25,68 D5.A 18.38,68 40,68 44.5,63.5 v44.5,61.12 | 14.81,59.06 15.12,58.75 15.62,58.75 U$6.8 15.75,58.62 19.5,54.88 19.5,53.62 U$6.4 | 14.81,59.06 v14.62,58.88 | v36.38,20.88 36.38,19.5 U$1.42
  Bottom 0.254: v14.62,58.88 14.62,58.75 15.88,58.75 R28.1 | v36.38,20.88 35.5,21.75 35.5,29.5 31.62,33.38 31.62,46.38 36.88,51.62 36.88,53.88 44.12,61.12 v44.5,61.12
VCC  (via drill 0.61)
  Top 0.254: 58.12,21 58.38,20.75 58.38,20.12 58,19.75 56,19.75 U$18.P$11 | 58.12,21 56,21 U$18.P$9 | v51.88,22.62 R38.1 | v52.5,24.5 53.75,23.25 55.88,23.25 U$18.P$6 56,23.12 58,23.12 58.38,22.75 58.38,21.38 58.12,21.12 58.12,21 | U$4.2 30.5,49.12 33.88,45.75 33.88,45.25 IC1.1 34,45.12 34,44.62 34.5,44.12 35.25,44.12 36.5,45.38 36.5,45.5 | 36.5,45.5 36.12,45.5 35.88,45.25 IC1.3 | 36.5,45.5 38.25,45.5 C21.2 38.38,45.62 39.62,46.88 39.62,47.38 | 39.62,47.38 39.62,54 47.38,61.75 52.75,61.75 R34.2 | 39.62,47.38 v47.5,47.38
  Bottom 0.254: v51.88,22.62 52.5,23.25 v52.5,24.5 52.5,24.62 52.88,25 52.88,42 v47.5,47.38
VDDA  (via drill 0.61)
  Top 0.254: C10.2 21.62,19.12 21.62,22.25 C11.2 21.75,22.25 v23.38,22.25 | U$3.2 17.25,32.5 18.25,32.5 21.75,29 C13.2 | C13.2 21.75,28.88 21.75,25.5 C12.2 21.75,25.38 v22.62,24.5 | U$1.13 33.38,30.75 33.38,30 32.75,29.38 21.5,29.38 C13.2
  Bottom 0.254: v23.38,22.25 22.62,23 v22.62,24.5

### Text on the board
tPlace: + / -
bPlace: + / / - | DigitalStethoscope v1 / 2020/04/30 / TonyGuo